# EAGLE schematic Tractive System Board Rev3 (EAGLE 9.6.2)

## Sheet 1 of 4
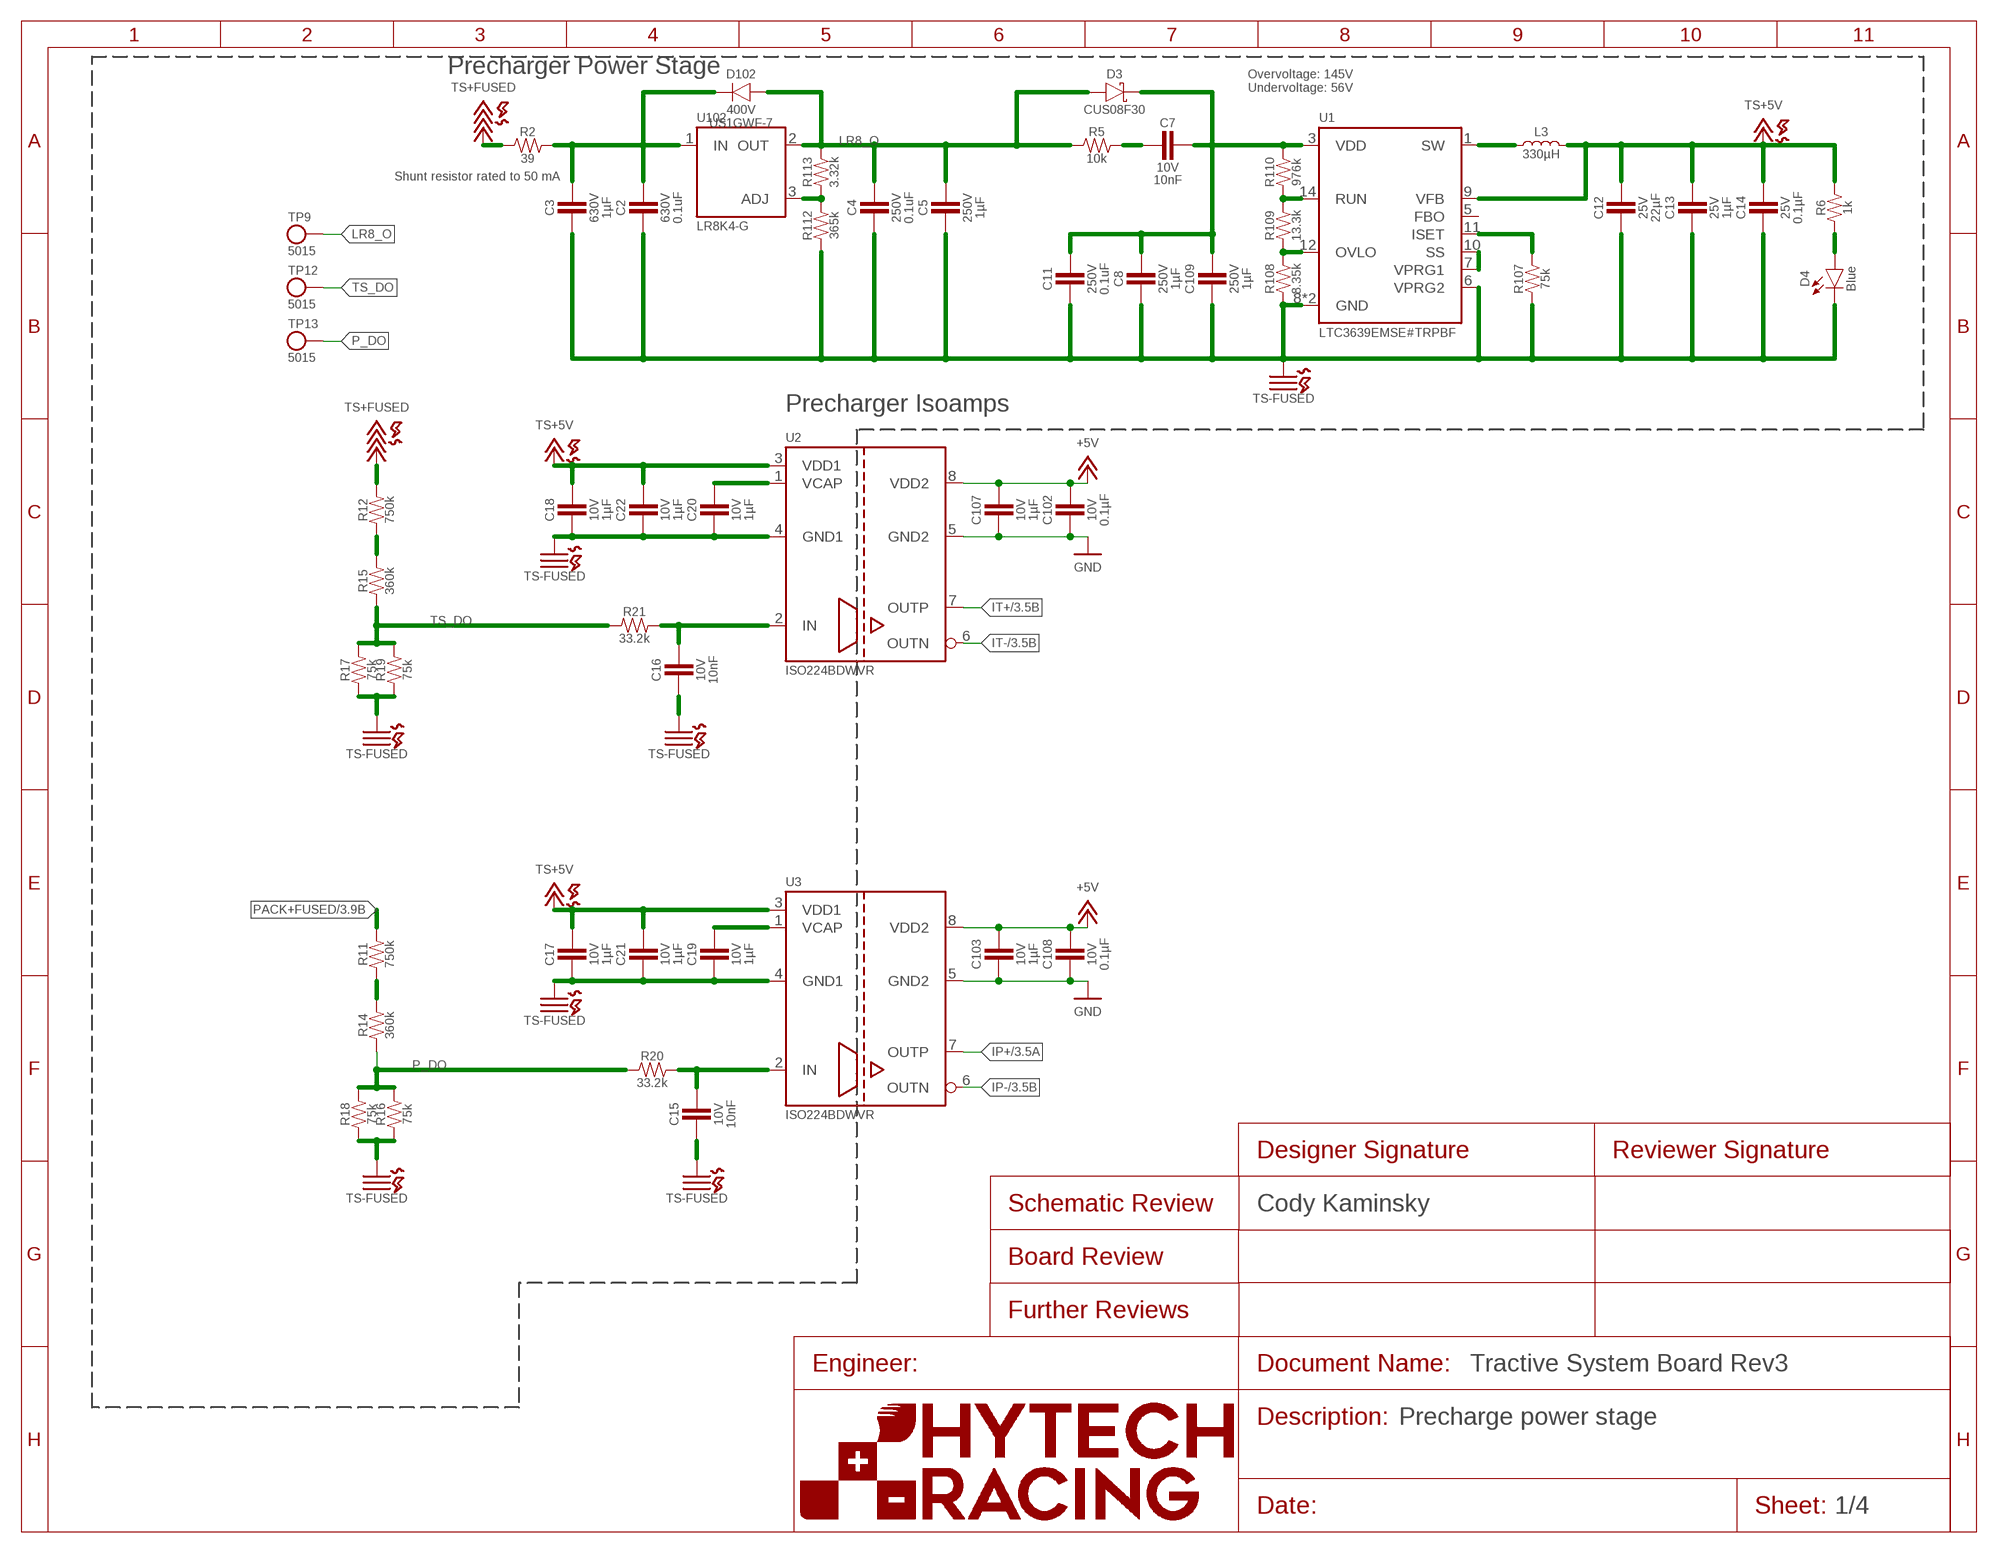
[diagram p0: schematic, sheet 1]
FRAME5 (FRAME): DESCRIPTION_1: Precharge power stage; DESIGNER_SCHEMATIC: Cody Kaminsky

### Parts
C2  CAPACITOR_2220_630V_0.1UF  [2220-CAP]
C3  CAPACITOR_2220_630V_1UF  [2220-CAP]
C4  CAPACITOR_1206_250V_0.1UF  [1206-CAP]
C5  CAPACITOR_2220_250V_1UF  [2220-CAP]
C7  CAPACITOR_0603_10V_10NF  [0603-CAP]
C8  CAPACITOR_2220_250V_1UF  [2220-CAP]
C11  CAPACITOR_1206_250V_0.1UF  [1206-CAP]
C12  CAPACITOR_0805_25V_22UF  [0805-CAP]
C13  CAPACITOR_0603_25V_1UF  [0603-CAP]
C14  CAPACITOR_0603_25V_0.1UF  [0603-CAP]
C15  CAPACITOR_0603_10V_10NF  [0603-CAP]
C16  CAPACITOR_0603_10V_10NF  [0603-CAP]
C17  CAPACITOR_0603_10V_1UF  [0603-CAP]
C18  CAPACITOR_0603_10V_1UF  [0603-CAP]
C19  CAPACITOR_0603_10V_1UF  [0603-CAP]
C20  CAPACITOR_0603_10V_1UF  [0603-CAP]
C21  CAPACITOR_0603_10V_1UF  [0603-CAP]
C22  CAPACITOR_0603_10V_1UF  [0603-CAP]
C102  CAPACITOR_0603_10V_0.1UF  [0603-CAP]
C103  CAPACITOR_0603_10V_1UF  [0603-CAP]
C107  CAPACITOR_0603_10V_1UF  [0603-CAP]
C108  CAPACITOR_0603_10V_0.1UF  [0603-CAP]
C109  CAPACITOR_2220_250V_1UF  [2220-CAP]
D3  SCHOTTKY_SOD323_30V  [SOD-323]
D4  LED_0603_BLUE  [0603-LED]
D102  RECTIFIER_400V_SOD123  [SOD123F]
L3  INDUCTOR_SRU1048_330UH  [SRU1048]
R2  RESISTOR_0603_39  [0603-RES]
R5  RESISTOR_0603_10K  [0603-RES]
R6  RESISTOR_0603_1K  [0603-RES]
R11  RESISTOR_0603_HV750K  [0603-RES]
R12  RESISTOR_0603_HV750K  [0603-RES]
R14  RESISTOR_0603_360K  [0603-RES]
R15  RESISTOR_0603_360K  [0603-RES]
R16  RESISTOR_0603_HV75K  [0603-RES]
R17  RESISTOR_0603_HV75K  [0603-RES]
R18  RESISTOR_0603_HV75K  [0603-RES]
R19  RESISTOR_0603_HV75K  [0603-RES]
R20  RESISTOR_0603_33.2K  [0603-RES]
R21  RESISTOR_0603_33.2K  [0603-RES]
R107  RESISTOR_0603_75K  [0603-RES]
R108  RESISTOR_0603_8.35K  [0603-RES]
R109  RESISTOR_0603_13.3K  [0603-RES]
R110  RESISTOR_0805_976K  [0805-RES]
R112  RESISTOR_0805_HV365K  [0805-RES]
R113  RESISTOR_0603_3.32K  [0603-RES]
TP9  TEST_POINT  [MICRO_MINIATURE]
TP12  TEST_POINT  [MICRO_MINIATURE]
TP13  TEST_POINT  [MICRO_MINIATURE]
U1  LTC3639  [MSE16(12)]
U2  ISO224B_AIRGAP  [SOIC-08(WIDE,0.295")-AIRGAP]
U3  ISO224B_AIRGAP  [SOIC-08(WIDE,0.295")-AIRGAP]
U102  VOLTAGE_REGULATOR_ADJ_LR8_DPAK  [DPAK(2-7K1S)]

### Nets
+5V: C102.1 C103.1 C107.1 C108.1 U2.8(VDD2) U3.8(VDD2) ; also sheet 2,3
GND: C102.2 C103.2 C107.2 C108.2 U2.5(GND2) U3.5(GND2) ; also sheet 2,3
IP+: U3.7(OUTP) ; also sheet 3
IP-: U3.6(OUTN) ; also sheet 3
IT+: U2.7(OUTP) ; also sheet 3
IT-: U2.6(OUTN) ; also sheet 3
LR8_O: C4.1 C5.1 D3.A D102.A R5.1 R113.2 TP9.1 U102.2(OUT)
N$1: R11.1 R14.2
N$2: R108.2 R109.1 U1.12(OVLO)
N$5: R109.2 R110.1 U1.14(RUN)
N$7: R12.1 R15.2
N$8: R112.2 R113.1 U102.3(ADJ)
N$15: C2.1 C3.1 D102.C R2.2 U102.1(IN)
N$35: D4.2(A) R6.1
N$60: C7.2 R5.2
N$61: C7.1 C8.1 C11.1 C109.1 D3.C R110.2 U1.3(VDD)
N$62: C15.1 R20.2 U3.2(IN)
N$63: C16.1 R21.2 U2.2(IN)
N$64: R107.2 U1.11(ISET)
N$65: L3.1 U1.1(SW)
N$69: C19.1 U3.1(VCAP)
N$73: C20.1 U2.1(VCAP)
N$76: U1.7(VPRG1) U1.10(SS)
P_DO: R14.1 R16.2 R18.2 R20.1 TP13.1
PACK+FUSED: R11.2 ; also sheet 3
TS+5V: C12.1 C13.1 C14.1 C17.1 C18.1 C21.1 C22.1 L3.2 R6.2 U1.9(VFB) U2.3(VDD1) U3.3(VDD1) ; also sheet 3
TS+FUSED: R2.1 R12.2 ; also sheet 2,3
TS-FUSED: C2.2 C3.2 C4.2 C5.2 C8.2 C11.2 C12.2 C13.2 C14.2 C15.2 C16.2 C17.2 C18.2 C19.2 C20.2 C21.2 C22.2 C109.2 D4.1(C) R16.1 R17.1 R18.1 R19.1 R107.1 R108.1 R112.1 U1.6(VPRG2) U1.8(GND) U1.16(GND) U2.4(GND1) U3.4(GND1) ; also sheet 2,3
TS_DO: R15.1 R17.2 R19.2 R21.1 TP12.1
Unconnected: U1.5(FBO)

### Notes on the sheet
- Precharger Power Stage
- Overvoltage: 145V
  Undervoltage: 56V
- Shunt resistor rated to 50 mA
- Precharger Isoamps

## Sheet 2 of 4
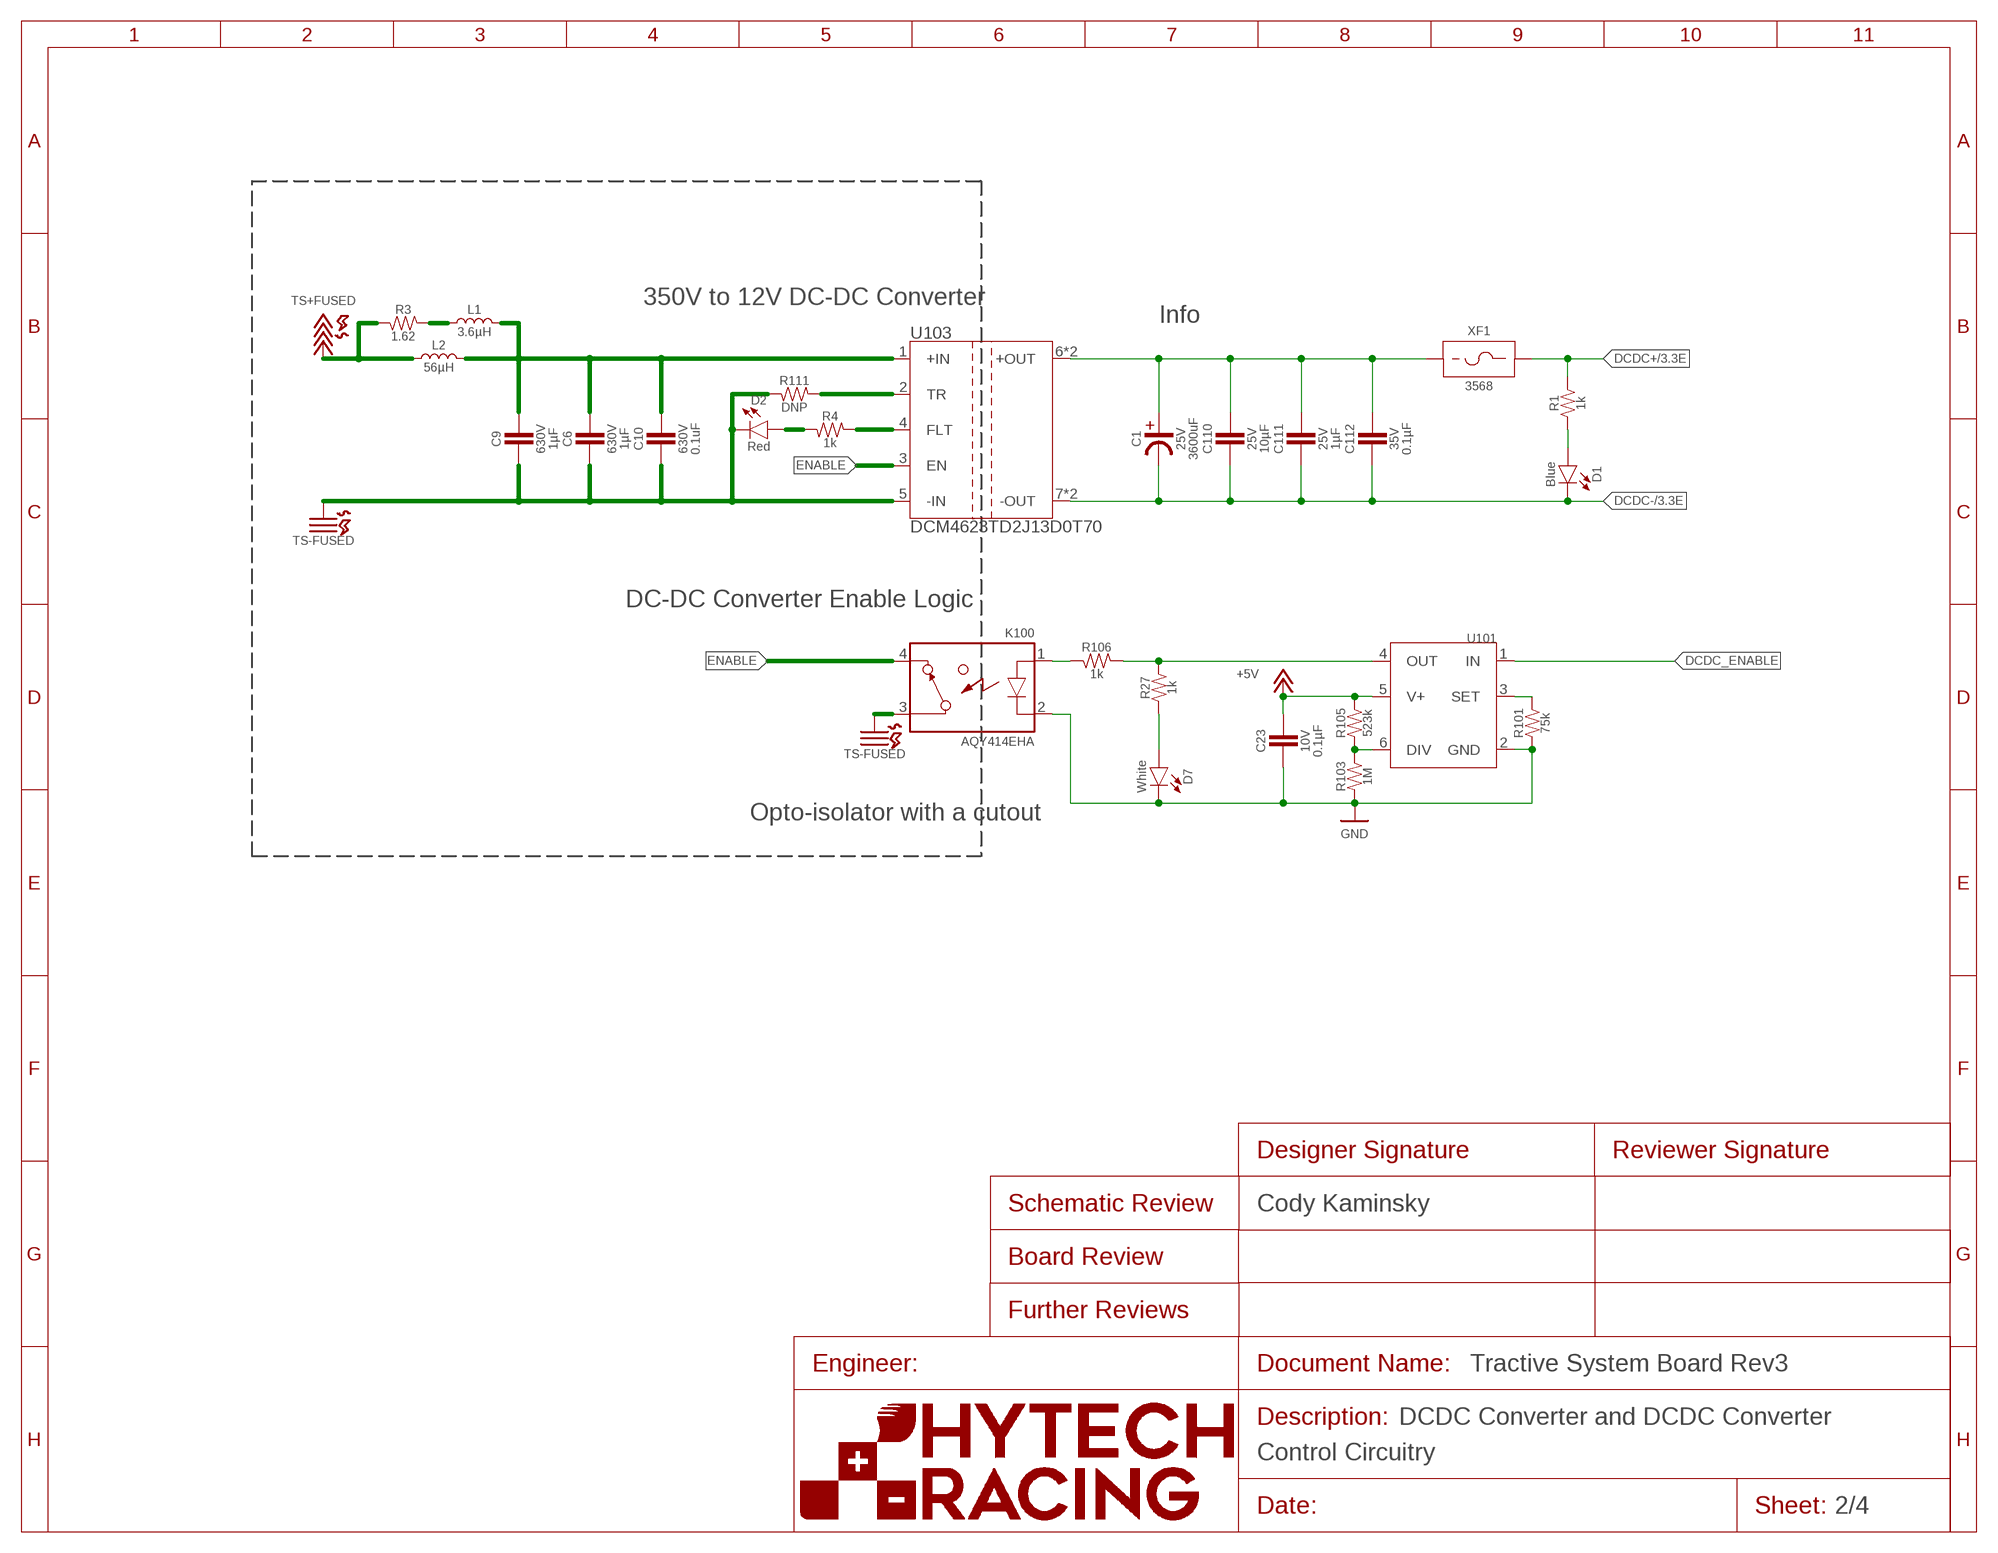
[diagram p1: schematic, sheet 2]
FRAME3 (FRAME): DESCRIPTION_1: DCDC Converter and DCDC Converter; DESCRIPTION_2: Control Circuitry; DESIGNER_SCHEMATIC: Cody Kaminsky

### Parts
C1  CAPACITOR_POLAR__3600UF  [EKYC*MM]
C6  CAPACITOR_2220_630V_1UF  [2220-CAP]
C9  CAPACITOR_2220_630V_1UF  [2220-CAP]
C10  CAPACITOR_2220_630V_0.1UF  [2220-CAP]
C23  CAPACITOR_0603_10V_0.1UF  [0603-CAP]
C110  CAPACITOR_0603_25V_10UF  [0603-CAP]
C111  CAPACITOR_0603_25V_1UF  [0603-CAP]
C112  CAPACITOR_0603_35V_0.1UF  [0603-CAP]
D1  LED_0603_BLUE  [0603-LED]
D2  LED_0603_RED  [0603-LED]
D7  LED_0603_WHITE  [0603-LED]
K100  RELAY_SOLIDSTATE_NC_AG  [DIP-4_AIRGAP]
L1  INDUCTOR_PA4334_3.6UH  [PA4334]
L2  INDUCTOR_WELMHI_56UH  [WE-LMHI]
R1  RESISTOR_0603_1K  [0603-RES]
R3  RESISTOR_0603_1.62  [0603-RES]
R4  RESISTOR_0603_1K  [0603-RES]
R27  RESISTOR_0603_1K  [0603-RES]
R101  RESISTOR_0603_75K  [0603-RES]
R103  RESISTOR_0805_1M  [0805-RES]
R105  RESISTOR_0805_523K  [0805-RES]
R106  RESISTOR_0603_1K  [0603-RES]
R111  RESISTOR_0603_DNP  [0603-RES]
U101  LTC6994-2  [SOT-23-6]
U103  DCM4623TD2J13D0T70  [DCM4623]
XF1  FUSE_HOLDER_MINIBLADEPTH  [3568]

### Nets
+5V: C23.1 R105.2 U101.5(V+) ; also sheet 1,3
DCDC+: R1.2 XF1.3 XF1.4 ; also sheet 3
DCDC-: C1.-(MINUS) C110.1 C111.1 C112.1 D1.1(C) U103.7(-OUT) U103.9(-OUT) ; also sheet 3
DCDC_ENABLE: U101.1(IN) ; also sheet 3
ENABLE: K100.4(CONTACT2) U103.3(EN)
GND: C23.2 D7.1(C) K100.2(CONTROL-) R101.1 R103.1 U101.2(GND) ; also sheet 1,3
N$4: R103.2 R105.1 U101.6(DIV)
N$6: K100.1(CONTROL+) R106.2
N$14: R101.2 U101.3(SET)
N$16: R27.2 R106.1 U101.4(OUT)
N$17: D7.2(A) R27.1
N$18: D1.2(A) R1.1
N$29: L1.2 R3.1
N$39: C6.1 C9.1 C10.1 L1.1 L2.1 U103.1(+IN)
N$43: D2.2(A) R4.2
N$44: R4.1 U103.4(FLT)
N$45: R111.1 U103.2(TR)
N$46: C1.+(PLUS) C110.2 C111.2 C112.2 U103.6(+OUT) U103.8(+OUT) XF1.1 XF1.2
TS+FUSED: L2.2 R3.2 ; also sheet 1,3
TS-FUSED: C6.2 C9.2 C10.2 D2.1(C) K100.3(CONTACT1) R111.2 U103.5(-IN) ; also sheet 1,3

### Notes on the sheet
- 350V to 12V DC-DC Converter
- Info
- DC-DC Converter Enable Logic
- Opto-isolator with a cutout

## Sheet 3 of 4
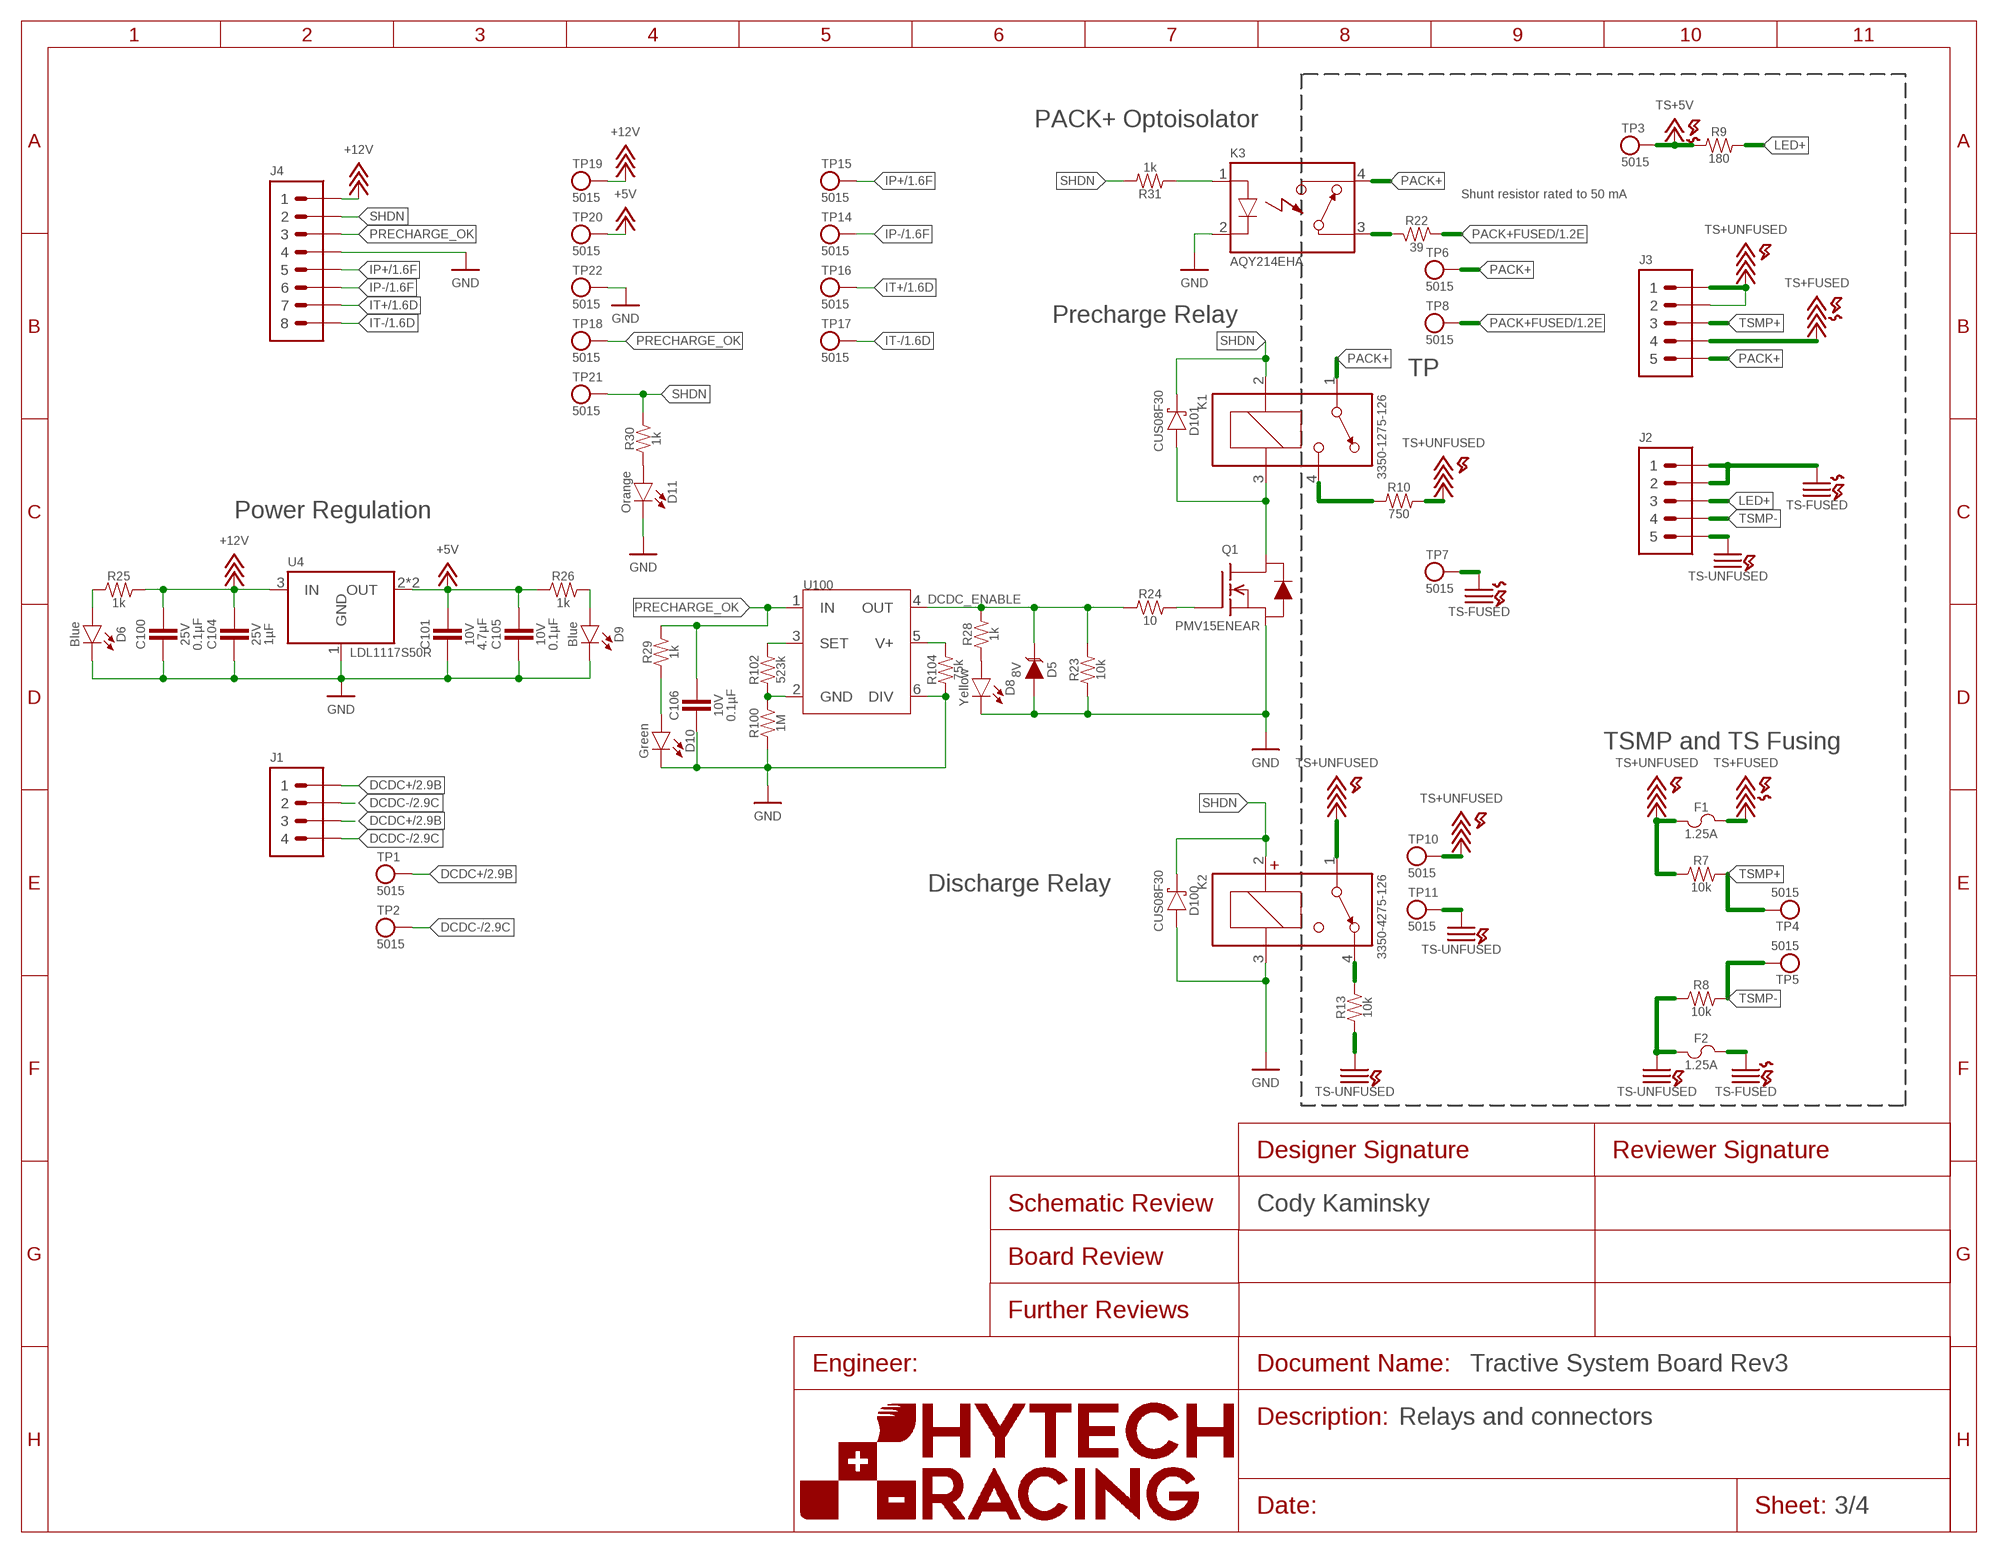
[diagram p2: schematic, sheet 3]
FRAME4 (FRAME): DESCRIPTION_1: Relays and connectors; DESIGNER_SCHEMATIC: Cody Kaminsky

### Parts
C100  CAPACITOR_0603_25V_0.1UF  [0603-CAP]
C101  CAPACITOR_0603_10V_4.7UF  [0603-CAP]
C104  CAPACITOR_0603_25V_1UF  [0603-CAP]
C105  CAPACITOR_0603_10V_0.1UF  [0603-CAP]
C106  CAPACITOR_0603_10V_0.1UF  [0603-CAP]
D5  TVS_8V  [SOT-23]
D6  LED_0603_BLUE  [0603-LED]
D8  LED_0603_YELLOW  [0603-LED]
D9  LED_0603_BLUE  [0603-LED]
D10  LED_0603_GREEN  [0603-LED]
D11  LED_0603_ORANGE  [0603-LED]
D100  SCHOTTKY_SOD323_30V  [SOD-323]
D101  SCHOTTKY_SOD323_30V  [SOD-323]
F1  FUSE_0885_1.25  [0885]
F2  FUSE_0885_1.25  [0885]
J1  CONNECTOR-4__  [MOLEX_MICROFIT_PTH_VERTICAL_04_DUAL]
J2  CONNECTOR-5_MICRO_V6S_  [MOLEX_MICROFIT_PTH_VERTICAL_06_SINGLE_SPACED]
J3  CONNECTOR-5_MICRO_V7S_  [MOLEX_MICROFIT_PTH_VERTICAL_07_SINGLE_SPACED]
J4  CONNECTOR-8_S_S  [FLEX_STACK_PTH_08_DUAL]
K1  RELAY_SPST_NO_3550_12  [335X]
K2  RELAY_SPST_NC_POLARIZED_3550_12  [335X]
K3  RELAY_SOLIDSTATE_NO_AG  [DIP-4_AIRGAP]
Q1  TRANSISTOR_N_MOS__PMV15ENEA  [SOT-23]
R7  RESISTOR_B20_10K  [B20]
R8  RESISTOR_B20_10K  [B20]
R9  RESISTOR_0603_180  [0603-RES]
R10  RESISTOR_B20_750  [B20]
R13  RESISTOR_B20_10K  [B20]
R22  RESISTOR_0603_39  [0603-RES]
R23  RESISTOR_0603_10K  [0603-RES]
R24  RESISTOR_0603_10  [0603-RES]
R25  RESISTOR_0603_1K  [0603-RES]
R26  RESISTOR_0603_1K  [0603-RES]
R28  RESISTOR_0603_1K  [0603-RES]
R29  RESISTOR_0603_1K  [0603-RES]
R30  RESISTOR_0603_1K  [0603-RES]
R31  RESISTOR_0603_1K  [0603-RES]
R100  RESISTOR_0805_1M  [0805-RES]
R102  RESISTOR_0805_523K  [0805-RES]
R104  RESISTOR_0603_75K  [0603-RES]
TP1  TEST_POINT  [MICRO_MINIATURE]
TP2  TEST_POINT  [MICRO_MINIATURE]
TP3  TEST_POINT  [MICRO_MINIATURE]
TP4  TEST_POINT  [MICRO_MINIATURE]
TP5  TEST_POINT  [MICRO_MINIATURE]
TP6  TEST_POINT  [MICRO_MINIATURE]
TP7  TEST_POINT  [MICRO_MINIATURE]
TP8  TEST_POINT  [MICRO_MINIATURE]
TP10  TEST_POINT  [MICRO_MINIATURE]
TP11  TEST_POINT  [MICRO_MINIATURE]
TP14  TEST_POINT  [MICRO_MINIATURE]
TP15  TEST_POINT  [MICRO_MINIATURE]
TP16  TEST_POINT  [MICRO_MINIATURE]
TP17  TEST_POINT  [MICRO_MINIATURE]
TP18  TEST_POINT  [MICRO_MINIATURE]
TP19  TEST_POINT  [MICRO_MINIATURE]
TP20  TEST_POINT  [MICRO_MINIATURE]
TP21  TEST_POINT  [MICRO_MINIATURE]
TP22  TEST_POINT  [MICRO_MINIATURE]
U4  VOLTAGE_REGULATOR_SOT223_5V  [SOT223]
U100  LTC6994-2  [SOT-23-6]

### Nets
+5V: C101.1 C105.1 R26.1 TP20.1 U4.2(OUT) U4.4(OUT) ; also sheet 1,2
+12V: C100.1 C104.1 J4.1 R25.2 TP19.1 U4.3(IN)
DCDC+: J1.1 J1.3 TP1.1 ; also sheet 2
DCDC-: J1.2 J1.4 TP2.1 ; also sheet 2
DCDC_ENABLE: D5.3(C) R23.2 R24.1 R28.2 U100.4(OUT) ; also sheet 2
GND: C100.2 C101.2 C104.2 C105.2 C106.2 D5.1(A) D6.1(C) D8.1(C) D9.1(C) D10.1(C) D11.1(C) D100.A J4.4 K2.3(COIL-) K3.2(CONTROL-) Q1.2(S) R23.1 R100.1 R104.1 TP22.1 U4.1(GND) U100.6(DIV) ; also sheet 1,2
IP+: J4.5 TP15.1 ; also sheet 1
IP-: J4.6 TP14.1 ; also sheet 1
IT+: J4.7 TP16.1 ; also sheet 1
IT-: J4.8 TP17.1 ; also sheet 1
LED+: J2.3 R9.2
N$3: Q1.1(G) R24.2
N$9: R100.2 R102.1 U100.2(GND)
N$10: R102.2 U100.3(SET)
N$12: R104.2 U100.5(V+)
N$22: D10.2(A) R29.1
N$24: D8.2(A) R28.1
N$25: D6.2(A) R25.1
N$30: D9.2(A) R26.2
N$31: D11.2(A) R30.1
N$40: D101.A K1.3(COIL-) Q1.3(D)
N$50: K1.4(CONTACT2) R10.1
N$51: K2.4(CONTACT2) R13.2
N$53: K3.1(CONTROL+) R31.1
N$57: K3.3(CONTACT1) R22.2
PACK+: J3.5 K1.1(CONTACT1) K3.4(CONTACT2) TP6.1
PACK+FUSED: R22.1 TP8.1 ; also sheet 1
PRECHARGE_OK: C106.1 J4.3 R29.2 TP18.1 U100.1(IN)
SHDN: D100.C D101.C J4.2 K1.2(COIL+) K2.2(COIL+) R30.2 R31.2 TP21.1
TS+5V: R9.1 TP3.1 ; also sheet 1
TS+FUSED: F1.2 J3.4 ; also sheet 1,2
TS+UNFUSED: F1.1 J3.1 J3.2 K2.1(CONTACT1) R7.1 R10.2 TP10.1
TS-FUSED: F2.2 J2.1 J2.2 TP7.1 ; also sheet 1,2
TS-UNFUSED: F2.1 J2.5 R8.1 R13.1 TP11.1
TSMP+: J3.3 R7.2 TP4.1
TSMP-: J2.4 R8.2 TP5.1

### Notes on the sheet
- PACK+ Optoisolator
- Shunt resistor rated to 50 mA
- Precharge Relay
- TP
- Power Regulation
- TSMP and TS Fusing
- Discharge Relay

## Sheet 4 of 4
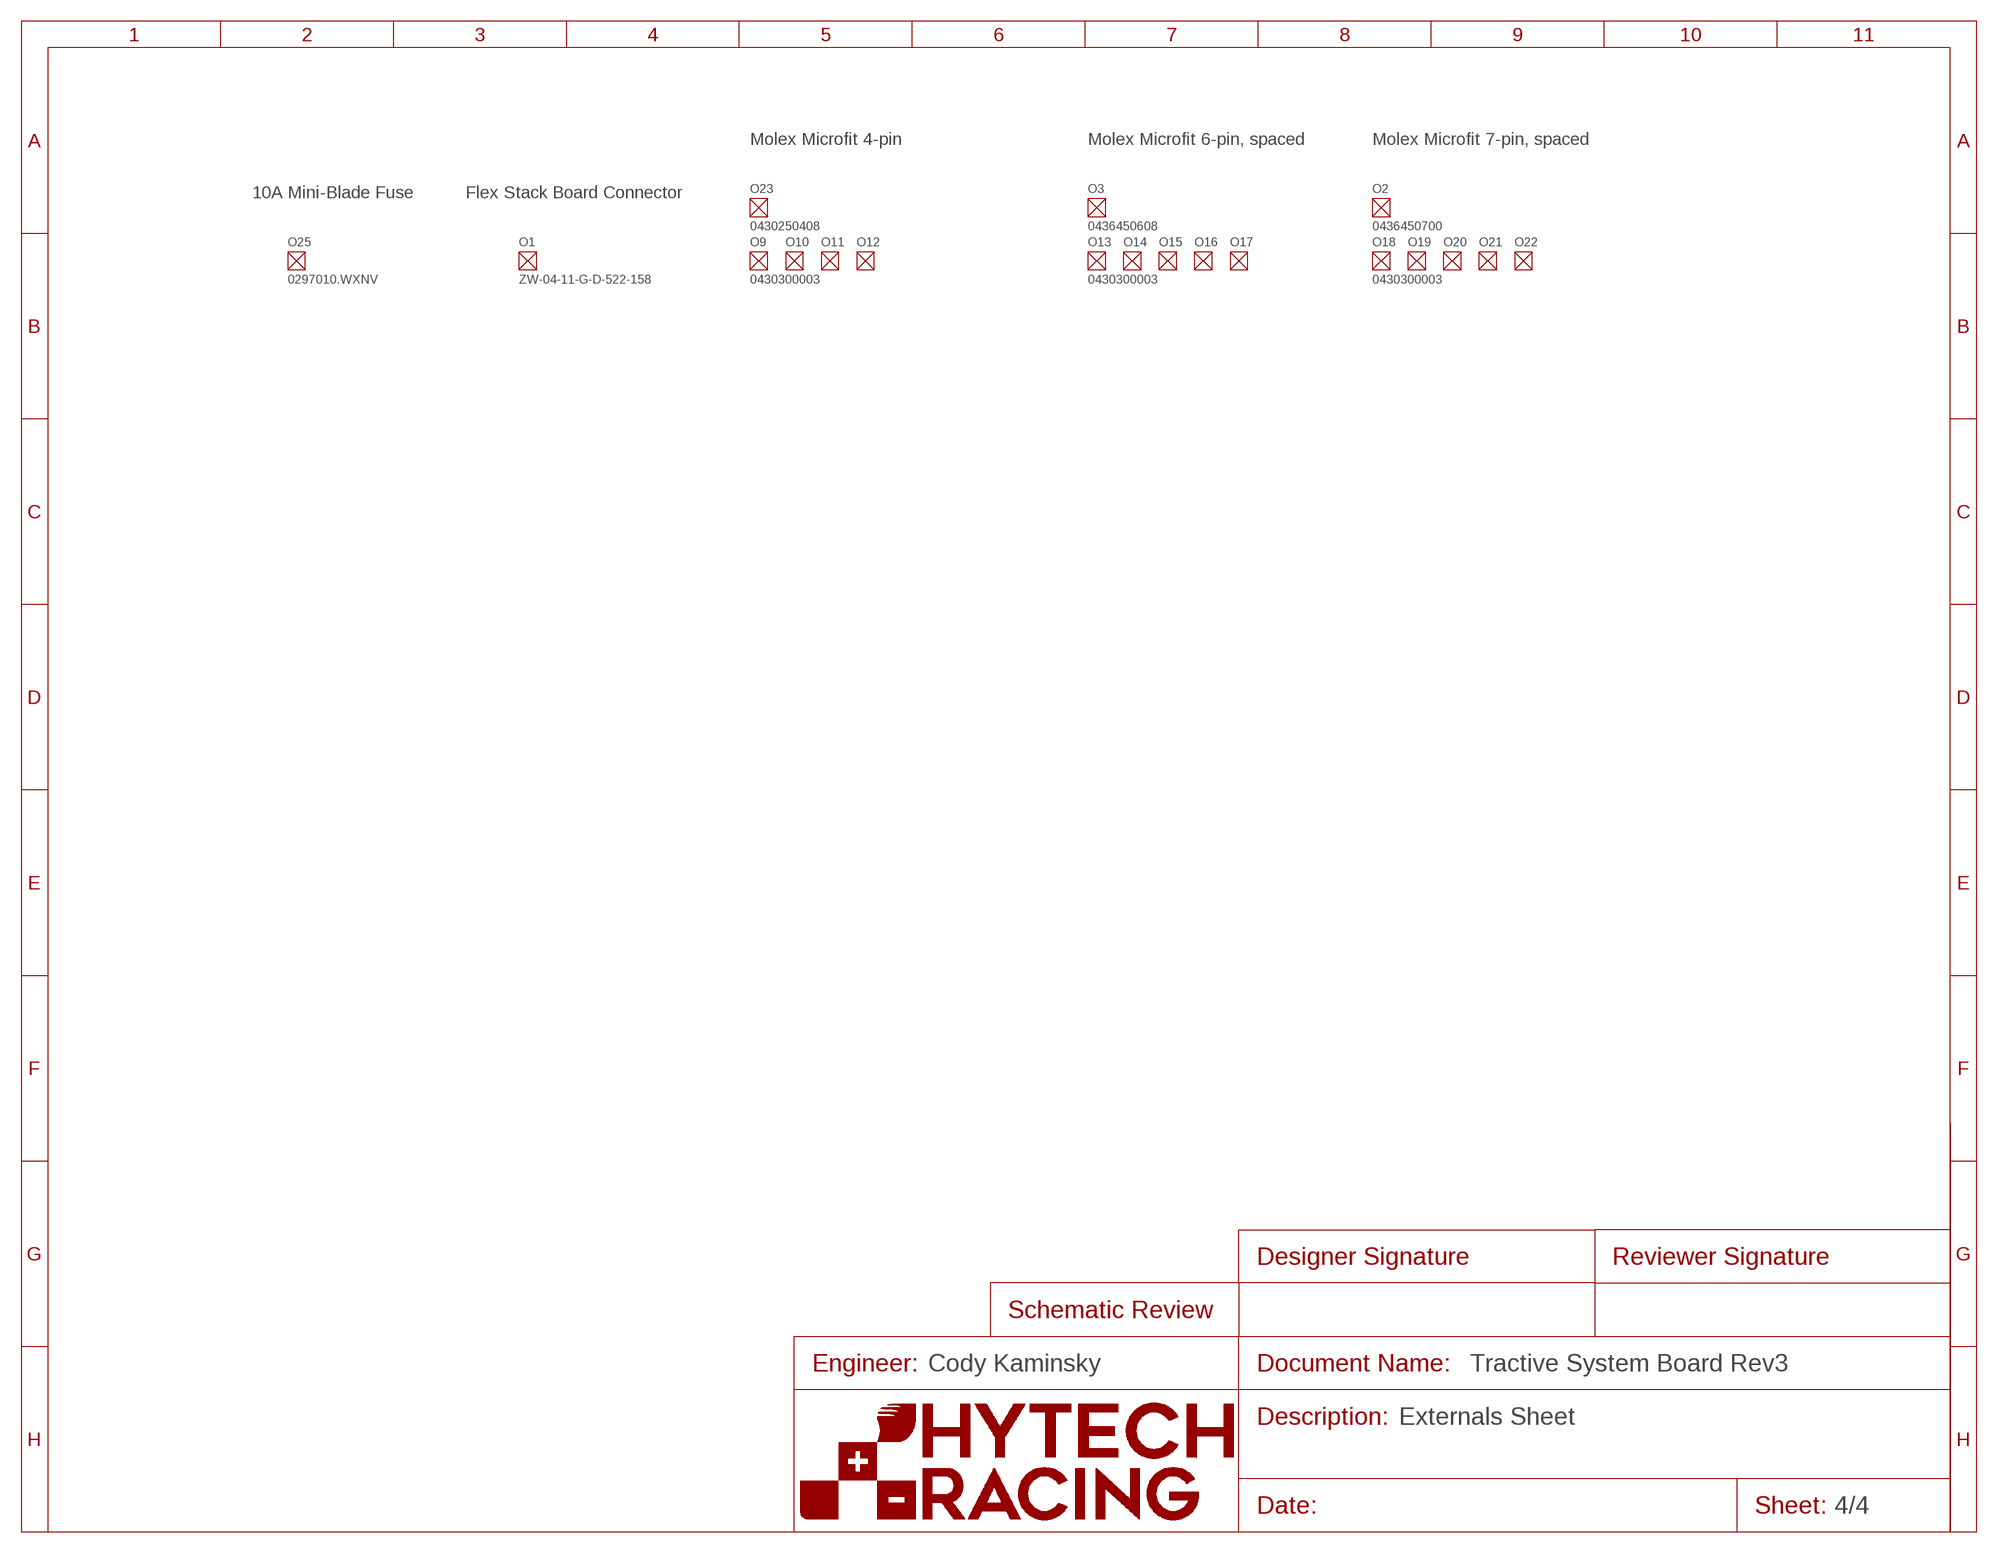
[diagram p3: schematic, sheet 4]
O1 (RECEPTACLE-8_FLEXSTACK): DKPN: ZW-04-11-G-D-522-158-ND; MANUFACTURER: Samtec Inc; MOPN: 200-ZW0411GD522158; MPN: ZW-04-11-G-D-522-158
O2 (RECEPTACLE-7_MICROFIT): DKPN: WM2405-ND; MANUFACTURER: Molex; MOPN: 538-43645-0700; MPN: 0436450700
O3 (RECEPTACLE-6_SINGLE_MICROFIT): DKPN: WM13217-ND; MANUFACTURER: Molex; MOPN: 538-43645-0608; MPN: 0436450608
O9 (CRIMP_MICROFIT_20-24): DKPN: WM2776CT-ND; GAUGE: 20-24; MANUFACTURER: Molex; MOPN: 538-43030-0003; MPN: 0430300003
O10 (CRIMP_MICROFIT_20-24): DKPN: WM2776CT-ND; GAUGE: 20-24; MANUFACTURER: Molex; MOPN: 538-43030-0003; MPN: 0430300003
O11 (CRIMP_MICROFIT_20-24): DKPN: WM2776CT-ND; GAUGE: 20-24; MANUFACTURER: Molex; MOPN: 538-43030-0003; MPN: 0430300003
O12 (CRIMP_MICROFIT_20-24): DKPN: WM2776CT-ND; GAUGE: 20-24; MANUFACTURER: Molex; MOPN: 538-43030-0003; MPN: 0430300003
O13 (CRIMP_MICROFIT_20-24): DKPN: WM2776CT-ND; GAUGE: 20-24; MANUFACTURER: Molex; MOPN: 538-43030-0003; MPN: 0430300003
O14 (CRIMP_MICROFIT_20-24): DKPN: WM2776CT-ND; GAUGE: 20-24; MANUFACTURER: Molex; MOPN: 538-43030-0003; MPN: 0430300003
O15 (CRIMP_MICROFIT_20-24): DKPN: WM2776CT-ND; GAUGE: 20-24; MANUFACTURER: Molex; MOPN: 538-43030-0003; MPN: 0430300003
O16 (CRIMP_MICROFIT_20-24): DKPN: WM2776CT-ND; GAUGE: 20-24; MANUFACTURER: Molex; MOPN: 538-43030-0003; MPN: 0430300003
O17 (CRIMP_MICROFIT_20-24): DKPN: WM2776CT-ND; GAUGE: 20-24; MANUFACTURER: Molex; MOPN: 538-43030-0003; MPN: 0430300003
O18 (CRIMP_MICROFIT_20-24): DKPN: WM2776CT-ND; GAUGE: 20-24; MANUFACTURER: Molex; MOPN: 538-43030-0003; MPN: 0430300003
O19 (CRIMP_MICROFIT_20-24): DKPN: WM2776CT-ND; GAUGE: 20-24; MANUFACTURER: Molex; MOPN: 538-43030-0003; MPN: 0430300003
O20 (CRIMP_MICROFIT_20-24): DKPN: WM2776CT-ND; GAUGE: 20-24; MANUFACTURER: Molex; MOPN: 538-43030-0003; MPN: 0430300003
O21 (CRIMP_MICROFIT_20-24): DKPN: WM2776CT-ND; GAUGE: 20-24; MANUFACTURER: Molex; MOPN: 538-43030-0003; MPN: 0430300003
O22 (CRIMP_MICROFIT_20-24): DKPN: WM2776CT-ND; GAUGE: 20-24; MANUFACTURER: Molex; MOPN: 538-43030-0003; MPN: 0430300003
O23 (RECEPTACLE-4_MICROFIT): DKPN: WM11225-ND; MANUFACTURER: Molex; MOPN: 538-43025-0408; MPN: 0430250408
O25 (FUSE_MINI_BLADE_10): DKPN: F991-ND; MANUFACTURER: Littelfuse; MOPN: 576-0297010.WXNV; MPN: 0297010.WXNV
U$49 (FRAME_SCHEMATIC_ONLY): DESCRIPTION_1: Externals Sheet; ENGINEER: Cody Kaminsky

### Notes on the sheet
- Molex Microfit 4-pin | Molex Microfit 6-pin, spaced | Molex Microfit 7-pin, spaced
- 10A Mini-Blade Fuse | Flex Stack Board Connector

## Library data of the parts
C1 = HyTechDevices:CAPACITOR_POLAR_?_*; CAPACITANCE: 3600uF; DKPN: 565-EKYC250ELL362ML20S-ND; MANUFACTURER: United Chemi-con; MOPN: 661-YC250ELL362ML20S; MPN: EKYC250ELL362ML20S; VOLTAGE: 25V
C2 C10 = HyTechDevices:CAPACITOR_?_*: Capacitor, Non-Polarized VJ...1BC Series Datasheet <https://www.mouser.com/datasheet/2/427/vjw1bcbascomseries-1762447.pdf> Samsung Datasheet <https://www.mouser.com/datasheet/2/585/MLCC-1837944.pdf> Walsin Datasheet <https://www.mouser.com/datasheet/2/210/WTC_MLCC_General_Purpose-1534899.pdf> GRM188R61A226ME15D <https://www.mouser.com/datasheet/2/281/1/GRM188R61A226ME15_02A-1985787.pdf> GRM188R61E106MA73D <https://www.mouser.com/datasheet/2/281/1/GRM188R61E106MA73_01A-1985806.pdf> 885012006013 <https://www.mouser.com/datasheet/2/445/885012006013-1726946.pdf> 2220Y6300105KXTWS2 <https://www.mouser.com/datasheet/2/218/SMD_High_and_Std_StackiCap_P62-1825512.pdf> Yageo Class 2, X5R <https://www.mouser.com/datasheet/2/447/UPY_GPHC_X5R_4V_to_50V_26-1827097.pdf> TDK C Series <https://www.mouser.com/ProductDetail/TDK/C3216X5R1V226M160AC?qs=%2Fha2pyFadujbcx9jh7lYl%2F4NeMoXFhdc8AqVWNq4wW6M2y7zl6GzBuhgtI0ngznN> AVX Automotive MLCC <https://www.mouser.com/datasheet/2/40/AutoMLCC-777028.pdf> KEMET X7R Series <https://www.mouser.com/datasheet/2/212/KEM_C1002_X7R_SMD-1102033.pdf>; CAPACITANCE: 0.1uF; DKPN: 445-11980-2-ND; MANUFACTURER: TDK Coporation; MOPN: 810-C5750CH2J104K2KC; MPN: C5750CH2J104K280KC; TOLERANCE: 10%; VOLTAGE: 630V
C3 C6 C9 = HyTechDevices:CAPACITOR_?_*: Capacitor, Non-Polarized VJ...1BC Series Datasheet <https://www.mouser.com/datasheet/2/427/vjw1bcbascomseries-1762447.pdf> Samsung Datasheet <https://www.mouser.com/datasheet/2/585/MLCC-1837944.pdf> Walsin Datasheet <https://www.mouser.com/datasheet/2/210/WTC_MLCC_General_Purpose-1534899.pdf> GRM188R61A226ME15D <https://www.mouser.com/datasheet/2/281/1/GRM188R61A226ME15_02A-1985787.pdf> GRM188R61E106MA73D <https://www.mouser.com/datasheet/2/281/1/GRM188R61E106MA73_01A-1985806.pdf> 885012006013 <https://www.mouser.com/datasheet/2/445/885012006013-1726946.pdf> 2220Y6300105KXTWS2 <https://www.mouser.com/datasheet/2/218/SMD_High_and_Std_StackiCap_P62-1825512.pdf> Yageo Class 2, X5R <https://www.mouser.com/datasheet/2/447/UPY_GPHC_X5R_4V_to_50V_26-1827097.pdf> TDK C Series <https://www.mouser.com/ProductDetail/TDK/C3216X5R1V226M160AC?qs=%2Fha2pyFadujbcx9jh7lYl%2F4NeMoXFhdc8AqVWNq4wW6M2y7zl6GzBuhgtI0ngznN> AVX Automotive MLCC <https://www.mouser.com/datasheet/2/40/AutoMLCC-777028.pdf> KEMET X7R Series <https://www.mouser.com/datasheet/2/212/KEM_C1002_X7R_SMD-1102033.pdf>; CAPACITANCE: 1µF; DKPN: 1608-2220Y6300105KXTWS2CT-ND; MANUFACTURER: Knowles Syfer; MOPN: 843-2220Y63105KXTWS2; MPN: 2220Y6300105KXTWS2; TOLERANCE: 10%; VOLTAGE: 630V
C4 C11 = HyTechDevices:CAPACITOR_?_*: Capacitor, Non-Polarized VJ...1BC Series Datasheet <https://www.mouser.com/datasheet/2/427/vjw1bcbascomseries-1762447.pdf> Samsung Datasheet <https://www.mouser.com/datasheet/2/585/MLCC-1837944.pdf> Walsin Datasheet <https://www.mouser.com/datasheet/2/210/WTC_MLCC_General_Purpose-1534899.pdf> GRM188R61A226ME15D <https://www.mouser.com/datasheet/2/281/1/GRM188R61A226ME15_02A-1985787.pdf> GRM188R61E106MA73D <https://www.mouser.com/datasheet/2/281/1/GRM188R61E106MA73_01A-1985806.pdf> 885012006013 <https://www.mouser.com/datasheet/2/445/885012006013-1726946.pdf> 2220Y6300105KXTWS2 <https://www.mouser.com/datasheet/2/218/SMD_High_and_Std_StackiCap_P62-1825512.pdf> Yageo Class 2, X5R <https://www.mouser.com/datasheet/2/447/UPY_GPHC_X5R_4V_to_50V_26-1827097.pdf> TDK C Series <https://www.mouser.com/ProductDetail/TDK/C3216X5R1V226M160AC?qs=%2Fha2pyFadujbcx9jh7lYl%2F4NeMoXFhdc8AqVWNq4wW6M2y7zl6GzBuhgtI0ngznN> AVX Automotive MLCC <https://www.mouser.com/datasheet/2/40/AutoMLCC-777028.pdf> KEMET X7R Series <https://www.mouser.com/datasheet/2/212/KEM_C1002_X7R_SMD-1102033.pdf>; CAPACITANCE: 0.1uF; DKPN: 445-6079-2-ND; MANUFACTURER: TDK Corporation; MOPN: 810-C3216X7R2E104KT5; MPN: C3216X7R2E104K160AM; TOLERANCE: 10%; VOLTAGE: 250V
C5 C8 C109 = HyTechDevices:CAPACITOR_?_*: Capacitor, Non-Polarized VJ...1BC Series Datasheet <https://www.mouser.com/datasheet/2/427/vjw1bcbascomseries-1762447.pdf> Samsung Datasheet <https://www.mouser.com/datasheet/2/585/MLCC-1837944.pdf> Walsin Datasheet <https://www.mouser.com/datasheet/2/210/WTC_MLCC_General_Purpose-1534899.pdf> GRM188R61A226ME15D <https://www.mouser.com/datasheet/2/281/1/GRM188R61A226ME15_02A-1985787.pdf> GRM188R61E106MA73D <https://www.mouser.com/datasheet/2/281/1/GRM188R61E106MA73_01A-1985806.pdf> 885012006013 <https://www.mouser.com/datasheet/2/445/885012006013-1726946.pdf> 2220Y6300105KXTWS2 <https://www.mouser.com/datasheet/2/218/SMD_High_and_Std_StackiCap_P62-1825512.pdf> Yageo Class 2, X5R <https://www.mouser.com/datasheet/2/447/UPY_GPHC_X5R_4V_to_50V_26-1827097.pdf> TDK C Series <https://www.mouser.com/ProductDetail/TDK/C3216X5R1V226M160AC?qs=%2Fha2pyFadujbcx9jh7lYl%2F4NeMoXFhdc8AqVWNq4wW6M2y7zl6GzBuhgtI0ngznN> AVX Automotive MLCC <https://www.mouser.com/datasheet/2/40/AutoMLCC-777028.pdf> KEMET X7R Series <https://www.mouser.com/datasheet/2/212/KEM_C1002_X7R_SMD-1102033.pdf>; CAPACITANCE: 1µF; DKPN: 445-2304-2-ND; MANUFACTURER: TDK Corporation; MOPN: 810-C5750X7R2E105K; MPN: C5750X7R2E105K230KA; TOLERANCE: 10%; VOLTAGE: 250V
C7 C15 C16 = HyTechDevices:CAPACITOR_?_*: Capacitor, Non-Polarized VJ...1BC Series Datasheet <https://www.mouser.com/datasheet/2/427/vjw1bcbascomseries-1762447.pdf> Samsung Datasheet <https://www.mouser.com/datasheet/2/585/MLCC-1837944.pdf> Walsin Datasheet <https://www.mouser.com/datasheet/2/210/WTC_MLCC_General_Purpose-1534899.pdf> GRM188R61A226ME15D <https://www.mouser.com/datasheet/2/281/1/GRM188R61A226ME15_02A-1985787.pdf> GRM188R61E106MA73D <https://www.mouser.com/datasheet/2/281/1/GRM188R61E106MA73_01A-1985806.pdf> 885012006013 <https://www.mouser.com/datasheet/2/445/885012006013-1726946.pdf> 2220Y6300105KXTWS2 <https://www.mouser.com/datasheet/2/218/SMD_High_and_Std_StackiCap_P62-1825512.pdf> Yageo Class 2, X5R <https://www.mouser.com/datasheet/2/447/UPY_GPHC_X5R_4V_to_50V_26-1827097.pdf> TDK C Series <https://www.mouser.com/ProductDetail/TDK/C3216X5R1V226M160AC?qs=%2Fha2pyFadujbcx9jh7lYl%2F4NeMoXFhdc8AqVWNq4wW6M2y7zl6GzBuhgtI0ngznN> AVX Automotive MLCC <https://www.mouser.com/datasheet/2/40/AutoMLCC-777028.pdf> KEMET X7R Series <https://www.mouser.com/datasheet/2/212/KEM_C1002_X7R_SMD-1102033.pdf>; CAPACITANCE: 10nF; DKPN: 311-4054-1-ND; MANUFACTURER: Yageo; MOPN: 603-CC603KRX7R6BB103; MPN: CC0603KRX7R6BB103; TOLERANCE: 10%; VOLTAGE: 10V
C12 = HyTechDevices:CAPACITOR_?_*: Capacitor, Non-Polarized VJ...1BC Series Datasheet <https://www.mouser.com/datasheet/2/427/vjw1bcbascomseries-1762447.pdf> Samsung Datasheet <https://www.mouser.com/datasheet/2/585/MLCC-1837944.pdf> Walsin Datasheet <https://www.mouser.com/datasheet/2/210/WTC_MLCC_General_Purpose-1534899.pdf> GRM188R61A226ME15D <https://www.mouser.com/datasheet/2/281/1/GRM188R61A226ME15_02A-1985787.pdf> GRM188R61E106MA73D <https://www.mouser.com/datasheet/2/281/1/GRM188R61E106MA73_01A-1985806.pdf> 885012006013 <https://www.mouser.com/datasheet/2/445/885012006013-1726946.pdf> 2220Y6300105KXTWS2 <https://www.mouser.com/datasheet/2/218/SMD_High_and_Std_StackiCap_P62-1825512.pdf> Yageo Class 2, X5R <https://www.mouser.com/datasheet/2/447/UPY_GPHC_X5R_4V_to_50V_26-1827097.pdf> TDK C Series <https://www.mouser.com/ProductDetail/TDK/C3216X5R1V226M160AC?qs=%2Fha2pyFadujbcx9jh7lYl%2F4NeMoXFhdc8AqVWNq4wW6M2y7zl6GzBuhgtI0ngznN> AVX Automotive MLCC <https://www.mouser.com/datasheet/2/40/AutoMLCC-777028.pdf> KEMET X7R Series <https://www.mouser.com/datasheet/2/212/KEM_C1002_X7R_SMD-1102033.pdf>; CAPACITANCE: 22µF; DKPN: 311-1903-1-ND; MANUFACTURER: Yageo; MOPN: 603-CC805MKX5R8BB226; MPN: CC0805MKX5R8BB226; TOLERANCE: 20%; VOLTAGE: 25V
C13 C104 C111 = HyTechDevices:CAPACITOR_?_*: Capacitor, Non-Polarized VJ...1BC Series Datasheet <https://www.mouser.com/datasheet/2/427/vjw1bcbascomseries-1762447.pdf> Samsung Datasheet <https://www.mouser.com/datasheet/2/585/MLCC-1837944.pdf> Walsin Datasheet <https://www.mouser.com/datasheet/2/210/WTC_MLCC_General_Purpose-1534899.pdf> GRM188R61A226ME15D <https://www.mouser.com/datasheet/2/281/1/GRM188R61A226ME15_02A-1985787.pdf> GRM188R61E106MA73D <https://www.mouser.com/datasheet/2/281/1/GRM188R61E106MA73_01A-1985806.pdf> 885012006013 <https://www.mouser.com/datasheet/2/445/885012006013-1726946.pdf> 2220Y6300105KXTWS2 <https://www.mouser.com/datasheet/2/218/SMD_High_and_Std_StackiCap_P62-1825512.pdf> Yageo Class 2, X5R <https://www.mouser.com/datasheet/2/447/UPY_GPHC_X5R_4V_to_50V_26-1827097.pdf> TDK C Series <https://www.mouser.com/ProductDetail/TDK/C3216X5R1V226M160AC?qs=%2Fha2pyFadujbcx9jh7lYl%2F4NeMoXFhdc8AqVWNq4wW6M2y7zl6GzBuhgtI0ngznN> AVX Automotive MLCC <https://www.mouser.com/datasheet/2/40/AutoMLCC-777028.pdf> KEMET X7R Series <https://www.mouser.com/datasheet/2/212/KEM_C1002_X7R_SMD-1102033.pdf>; CAPACITANCE: 1µF; DKPN: 1276-1184-1-ND; MANUFACTURER: Samsung Electro-Mechanics; MOPN: 187-CL10B105KA8NNNC; MPN: CL10B105KA8NNNC; TOLERANCE: 10%; VOLTAGE: 25V
C14 C100 = HyTechDevices:CAPACITOR_?_*: Capacitor, Non-Polarized VJ...1BC Series Datasheet <https://www.mouser.com/datasheet/2/427/vjw1bcbascomseries-1762447.pdf> Samsung Datasheet <https://www.mouser.com/datasheet/2/585/MLCC-1837944.pdf> Walsin Datasheet <https://www.mouser.com/datasheet/2/210/WTC_MLCC_General_Purpose-1534899.pdf> GRM188R61A226ME15D <https://www.mouser.com/datasheet/2/281/1/GRM188R61A226ME15_02A-1985787.pdf> GRM188R61E106MA73D <https://www.mouser.com/datasheet/2/281/1/GRM188R61E106MA73_01A-1985806.pdf> 885012006013 <https://www.mouser.com/datasheet/2/445/885012006013-1726946.pdf> 2220Y6300105KXTWS2 <https://www.mouser.com/datasheet/2/218/SMD_High_and_Std_StackiCap_P62-1825512.pdf> Yageo Class 2, X5R <https://www.mouser.com/datasheet/2/447/UPY_GPHC_X5R_4V_to_50V_26-1827097.pdf> TDK C Series <https://www.mouser.com/ProductDetail/TDK/C3216X5R1V226M160AC?qs=%2Fha2pyFadujbcx9jh7lYl%2F4NeMoXFhdc8AqVWNq4wW6M2y7zl6GzBuhgtI0ngznN> AVX Automotive MLCC <https://www.mouser.com/datasheet/2/40/AutoMLCC-777028.pdf> KEMET X7R Series <https://www.mouser.com/datasheet/2/212/KEM_C1002_X7R_SMD-1102033.pdf>; CAPACITANCE: 0.1µF; DKPN: 1276-1006-1-ND; MANUFACTURER: Samsung Electro-Mechanics; MOPN: 187-CL10B104KA8NNNC; MPN: CL10B104KA8NNNC; TOLERANCE: 10%; VOLTAGE: 25V
C17-C22 C103 C107 = HyTechDevices:CAPACITOR_?_*: Capacitor, Non-Polarized VJ...1BC Series Datasheet <https://www.mouser.com/datasheet/2/427/vjw1bcbascomseries-1762447.pdf> Samsung Datasheet <https://www.mouser.com/datasheet/2/585/MLCC-1837944.pdf> Walsin Datasheet <https://www.mouser.com/datasheet/2/210/WTC_MLCC_General_Purpose-1534899.pdf> GRM188R61A226ME15D <https://www.mouser.com/datasheet/2/281/1/GRM188R61A226ME15_02A-1985787.pdf> GRM188R61E106MA73D <https://www.mouser.com/datasheet/2/281/1/GRM188R61E106MA73_01A-1985806.pdf> 885012006013 <https://www.mouser.com/datasheet/2/445/885012006013-1726946.pdf> 2220Y6300105KXTWS2 <https://www.mouser.com/datasheet/2/218/SMD_High_and_Std_StackiCap_P62-1825512.pdf> Yageo Class 2, X5R <https://www.mouser.com/datasheet/2/447/UPY_GPHC_X5R_4V_to_50V_26-1827097.pdf> TDK C Series <https://www.mouser.com/ProductDetail/TDK/C3216X5R1V226M160AC?qs=%2Fha2pyFadujbcx9jh7lYl%2F4NeMoXFhdc8AqVWNq4wW6M2y7zl6GzBuhgtI0ngznN> AVX Automotive MLCC <https://www.mouser.com/datasheet/2/40/AutoMLCC-777028.pdf> KEMET X7R Series <https://www.mouser.com/datasheet/2/212/KEM_C1002_X7R_SMD-1102033.pdf>; CAPACITANCE: 1µF; DKPN: 311-1796-1-ND; MANUFACTURER: Yageo; MOPN: 603-CC603KRX7R6BB105; MPN: CC0603KRX7R6BB105; TOLERANCE: 10%; VOLTAGE: 10V
C23 C102 C105 C106 C108 = HyTechDevices:CAPACITOR_?_*: Capacitor, Non-Polarized VJ...1BC Series Datasheet <https://www.mouser.com/datasheet/2/427/vjw1bcbascomseries-1762447.pdf> Samsung Datasheet <https://www.mouser.com/datasheet/2/585/MLCC-1837944.pdf> Walsin Datasheet <https://www.mouser.com/datasheet/2/210/WTC_MLCC_General_Purpose-1534899.pdf> GRM188R61A226ME15D <https://www.mouser.com/datasheet/2/281/1/GRM188R61A226ME15_02A-1985787.pdf> GRM188R61E106MA73D <https://www.mouser.com/datasheet/2/281/1/GRM188R61E106MA73_01A-1985806.pdf> 885012006013 <https://www.mouser.com/datasheet/2/445/885012006013-1726946.pdf> 2220Y6300105KXTWS2 <https://www.mouser.com/datasheet/2/218/SMD_High_and_Std_StackiCap_P62-1825512.pdf> Yageo Class 2, X5R <https://www.mouser.com/datasheet/2/447/UPY_GPHC_X5R_4V_to_50V_26-1827097.pdf> TDK C Series <https://www.mouser.com/ProductDetail/TDK/C3216X5R1V226M160AC?qs=%2Fha2pyFadujbcx9jh7lYl%2F4NeMoXFhdc8AqVWNq4wW6M2y7zl6GzBuhgtI0ngznN> AVX Automotive MLCC <https://www.mouser.com/datasheet/2/40/AutoMLCC-777028.pdf> KEMET X7R Series <https://www.mouser.com/datasheet/2/212/KEM_C1002_X7R_SMD-1102033.pdf>; CAPACITANCE: 0.1µF; DKPN: 720-1688-1-ND; MANUFACTURER: Vishay Vitramon; MOPN: 77-VJ0603Y104JXQPBC; MPN: VJ0603Y104JXQPW1BC; TOLERANCE: 5%; VOLTAGE: 10V
C101 = HyTechDevices:CAPACITOR_?_*: Capacitor, Non-Polarized VJ...1BC Series Datasheet <https://www.mouser.com/datasheet/2/427/vjw1bcbascomseries-1762447.pdf> Samsung Datasheet <https://www.mouser.com/datasheet/2/585/MLCC-1837944.pdf> Walsin Datasheet <https://www.mouser.com/datasheet/2/210/WTC_MLCC_General_Purpose-1534899.pdf> GRM188R61A226ME15D <https://www.mouser.com/datasheet/2/281/1/GRM188R61A226ME15_02A-1985787.pdf> GRM188R61E106MA73D <https://www.mouser.com/datasheet/2/281/1/GRM188R61E106MA73_01A-1985806.pdf> 885012006013 <https://www.mouser.com/datasheet/2/445/885012006013-1726946.pdf> 2220Y6300105KXTWS2 <https://www.mouser.com/datasheet/2/218/SMD_High_and_Std_StackiCap_P62-1825512.pdf> Yageo Class 2, X5R <https://www.mouser.com/datasheet/2/447/UPY_GPHC_X5R_4V_to_50V_26-1827097.pdf> TDK C Series <https://www.mouser.com/ProductDetail/TDK/C3216X5R1V226M160AC?qs=%2Fha2pyFadujbcx9jh7lYl%2F4NeMoXFhdc8AqVWNq4wW6M2y7zl6GzBuhgtI0ngznN> AVX Automotive MLCC <https://www.mouser.com/datasheet/2/40/AutoMLCC-777028.pdf> KEMET X7R Series <https://www.mouser.com/datasheet/2/212/KEM_C1002_X7R_SMD-1102033.pdf>; CAPACITANCE: 4.7µF; DKPN: 1276-1044-1-ND; MANUFACTURER: Samsung Electro-Mechanics; MOPN: 187-CL10A475KP8NNNC; MPN: CL10A475KP8NNNC; TOLERANCE: 10%; VOLTAGE: 10V
C110 = HyTechDevices:CAPACITOR_?_*: Capacitor, Non-Polarized VJ...1BC Series Datasheet <https://www.mouser.com/datasheet/2/427/vjw1bcbascomseries-1762447.pdf> Samsung Datasheet <https://www.mouser.com/datasheet/2/585/MLCC-1837944.pdf> Walsin Datasheet <https://www.mouser.com/datasheet/2/210/WTC_MLCC_General_Purpose-1534899.pdf> GRM188R61A226ME15D <https://www.mouser.com/datasheet/2/281/1/GRM188R61A226ME15_02A-1985787.pdf> GRM188R61E106MA73D <https://www.mouser.com/datasheet/2/281/1/GRM188R61E106MA73_01A-1985806.pdf> 885012006013 <https://www.mouser.com/datasheet/2/445/885012006013-1726946.pdf> 2220Y6300105KXTWS2 <https://www.mouser.com/datasheet/2/218/SMD_High_and_Std_StackiCap_P62-1825512.pdf> Yageo Class 2, X5R <https://www.mouser.com/datasheet/2/447/UPY_GPHC_X5R_4V_to_50V_26-1827097.pdf> TDK C Series <https://www.mouser.com/ProductDetail/TDK/C3216X5R1V226M160AC?qs=%2Fha2pyFadujbcx9jh7lYl%2F4NeMoXFhdc8AqVWNq4wW6M2y7zl6GzBuhgtI0ngznN> AVX Automotive MLCC <https://www.mouser.com/datasheet/2/40/AutoMLCC-777028.pdf> KEMET X7R Series <https://www.mouser.com/datasheet/2/212/KEM_C1002_X7R_SMD-1102033.pdf>; CAPACITANCE: 10µF; DKPN: 490-7202-1-ND; MANUFACTURER: Murata Electronics; MOPN: 81-GRM188R61E106MA3D; MPN: GRM188R61E106MA73D; TOLERANCE: 20%; VOLTAGE: 25V
C112 = HyTechDevices:CAPACITOR_?_*: Capacitor, Non-Polarized VJ...1BC Series Datasheet <https://www.mouser.com/datasheet/2/427/vjw1bcbascomseries-1762447.pdf> Samsung Datasheet <https://www.mouser.com/datasheet/2/585/MLCC-1837944.pdf> Walsin Datasheet <https://www.mouser.com/datasheet/2/210/WTC_MLCC_General_Purpose-1534899.pdf> GRM188R61A226ME15D <https://www.mouser.com/datasheet/2/281/1/GRM188R61A226ME15_02A-1985787.pdf> GRM188R61E106MA73D <https://www.mouser.com/datasheet/2/281/1/GRM188R61E106MA73_01A-1985806.pdf> 885012006013 <https://www.mouser.com/datasheet/2/445/885012006013-1726946.pdf> 2220Y6300105KXTWS2 <https://www.mouser.com/datasheet/2/218/SMD_High_and_Std_StackiCap_P62-1825512.pdf> Yageo Class 2, X5R <https://www.mouser.com/datasheet/2/447/UPY_GPHC_X5R_4V_to_50V_26-1827097.pdf> TDK C Series <https://www.mouser.com/ProductDetail/TDK/C3216X5R1V226M160AC?qs=%2Fha2pyFadujbcx9jh7lYl%2F4NeMoXFhdc8AqVWNq4wW6M2y7zl6GzBuhgtI0ngznN> AVX Automotive MLCC <https://www.mouser.com/datasheet/2/40/AutoMLCC-777028.pdf> KEMET X7R Series <https://www.mouser.com/datasheet/2/212/KEM_C1002_X7R_SMD-1102033.pdf>; CAPACITANCE: 0.1µF; DKPN: 587-3354-1-ND; MANUFACTURER: Taiyo Yuden; MOPN: 963-GMK107B7104KAHT; MPN: GMK107B7104KAHT; TOLERANCE: 10%; VOLTAGE: 35V
D1 D4 D6 D9 = HyTechDevices:LED_?_*: LED 0603 Blue <https://www.mouser.com/datasheet/2/216/APT1608VBC_D-246010.pdf> Green <https://www.mouser.com/datasheet/2/216/APT1608ZGCK-1173388.pdf> Orange <https://www.mouser.com/datasheet/2/216/APT1608SECK-6197.pdf> Red <https://www.mouser.com/datasheet/2/216/APT1608SECK-J3-PRV-1173336.pdf> White <https://www.mouser.com/datasheet/2/50/SM0603UWC-880813.pdf> Yellow <https://www.mouser.com/datasheet/2/216/APT1608SYCK-J3-PRV-1173311.pdf> 2835 (Series not on Digikey) Lumiled LUXEON 2835 Color Line <https://www.mouser.com/datasheet/2/602/DS236_luxeon_2835_color_line_datasheet-1596094.pdf>; COLOR: Blue; DKPN: 754-1789-1-ND; MANUFACTURER: Kingbright; MOPN: 604-APT1608VBC/D; MPN: APT1608VBC/D
D2 = HyTechDevices:LED_?_*: LED 0603 Blue <https://www.mouser.com/datasheet/2/216/APT1608VBC_D-246010.pdf> Green <https://www.mouser.com/datasheet/2/216/APT1608ZGCK-1173388.pdf> Orange <https://www.mouser.com/datasheet/2/216/APT1608SECK-6197.pdf> Red <https://www.mouser.com/datasheet/2/216/APT1608SECK-J3-PRV-1173336.pdf> White <https://www.mouser.com/datasheet/2/50/SM0603UWC-880813.pdf> Yellow <https://www.mouser.com/datasheet/2/216/APT1608SYCK-J3-PRV-1173311.pdf> 2835 (Series not on Digikey) Lumiled LUXEON 2835 Color Line <https://www.mouser.com/datasheet/2/602/DS236_luxeon_2835_color_line_datasheet-1596094.pdf>; COLOR: Red; DKPN: 754-1786-1-ND; MANUFACTURER: Kingbright; MOPN: 604-APT1608SECKJ3PRV; MPN: APT1608SECK/J3-PRV
D3 D100 D101 = HyTechDevices:SCHOTTKY_?_*: CUS08F30 Shottky Diode Datasheet <https://www.mouser.com/datasheet/2/408/CUS08F30_datasheet_en_20140414-1916097.pdf>; CURRENT: 0.8A; DKPN: CUS08F30H3FTR-ND; MANUFACTURER: Toshiba Semiconductor and Storage; MOPN: 757-CUS08F30H3F; MPN: CUS08F30; VOLTAGE: 30V
D5 = HyTechDevices:TVS_*: TVS Diode GSOT Datasheet <https://www.mouser.com/datasheet/2/427/gsot03-1767593.pdf>; DKPN: GSOT08-E3-08TR-ND; MANUFACTURER: Vishay General Semiconductor - Diodes Division; MOPN: 78-GSOT08-E3-08; MPN: GSOT08-E3-08; VOLTAGE: 8V
D7 = HyTechDevices:LED_?_*: LED 0603 Blue <https://www.mouser.com/datasheet/2/216/APT1608VBC_D-246010.pdf> Green <https://www.mouser.com/datasheet/2/216/APT1608ZGCK-1173388.pdf> Orange <https://www.mouser.com/datasheet/2/216/APT1608SECK-6197.pdf> Red <https://www.mouser.com/datasheet/2/216/APT1608SECK-J3-PRV-1173336.pdf> White <https://www.mouser.com/datasheet/2/50/SM0603UWC-880813.pdf> Yellow <https://www.mouser.com/datasheet/2/216/APT1608SYCK-J3-PRV-1173311.pdf> 2835 (Series not on Digikey) Lumiled LUXEON 2835 Color Line <https://www.mouser.com/datasheet/2/602/DS236_luxeon_2835_color_line_datasheet-1596094.pdf>; COLOR: White; DKPN: SM0603UWC-ND; MANUFACTURER: Bivar Inc.; MOPN: 749-SM0603UWC; MPN: SM0603UWC
D8 = HyTechDevices:LED_?_*: LED 0603 Blue <https://www.mouser.com/datasheet/2/216/APT1608VBC_D-246010.pdf> Green <https://www.mouser.com/datasheet/2/216/APT1608ZGCK-1173388.pdf> Orange <https://www.mouser.com/datasheet/2/216/APT1608SECK-6197.pdf> Red <https://www.mouser.com/datasheet/2/216/APT1608SECK-J3-PRV-1173336.pdf> White <https://www.mouser.com/datasheet/2/50/SM0603UWC-880813.pdf> Yellow <https://www.mouser.com/datasheet/2/216/APT1608SYCK-J3-PRV-1173311.pdf> 2835 (Series not on Digikey) Lumiled LUXEON 2835 Color Line <https://www.mouser.com/datasheet/2/602/DS236_luxeon_2835_color_line_datasheet-1596094.pdf>; COLOR: Yellow; DKPN: 754-1788-1-ND; MANUFACTURER: Kingbright; MOPN: 604-APT1608SYCK/J3-PRV; MPN: APT1608SYCK/J3-PRV
D10 = HyTechDevices:LED_?_*: LED 0603 Blue <https://www.mouser.com/datasheet/2/216/APT1608VBC_D-246010.pdf> Green <https://www.mouser.com/datasheet/2/216/APT1608ZGCK-1173388.pdf> Orange <https://www.mouser.com/datasheet/2/216/APT1608SECK-6197.pdf> Red <https://www.mouser.com/datasheet/2/216/APT1608SECK-J3-PRV-1173336.pdf> White <https://www.mouser.com/datasheet/2/50/SM0603UWC-880813.pdf> Yellow <https://www.mouser.com/datasheet/2/216/APT1608SYCK-J3-PRV-1173311.pdf> 2835 (Series not on Digikey) Lumiled LUXEON 2835 Color Line <https://www.mouser.com/datasheet/2/602/DS236_luxeon_2835_color_line_datasheet-1596094.pdf>; COLOR: Green; DKPN: 754-1790-1-ND; MANUFACTURER: Kingbright; MOPN: 604-APT1608ZGCK; MPN: APT1608ZGCK
D11 = HyTechDevices:LED_?_*: LED 0603 Blue <https://www.mouser.com/datasheet/2/216/APT1608VBC_D-246010.pdf> Green <https://www.mouser.com/datasheet/2/216/APT1608ZGCK-1173388.pdf> Orange <https://www.mouser.com/datasheet/2/216/APT1608SECK-6197.pdf> Red <https://www.mouser.com/datasheet/2/216/APT1608SECK-J3-PRV-1173336.pdf> White <https://www.mouser.com/datasheet/2/50/SM0603UWC-880813.pdf> Yellow <https://www.mouser.com/datasheet/2/216/APT1608SYCK-J3-PRV-1173311.pdf> 2835 (Series not on Digikey) Lumiled LUXEON 2835 Color Line <https://www.mouser.com/datasheet/2/602/DS236_luxeon_2835_color_line_datasheet-1596094.pdf>; COLOR: Orange; DKPN: 754-1120-1-ND; MANUFACTURER: Kingbright; MOPN: 604-APT1608SECK; MPN: APT1608SECK
D102 = HyTechDevicesTempTSB:RECTIFIER_*_?; CURRENT: 1A; DKPN: US1GWF-7DITR-ND; MANUFACTURER: Diodes Incorporated; MOPN: 621-US1GWF-7; MPN: US1GWF-7; VOLTAGE: 400V
F1 F2 = HyTechDevices:FUSE_?_*: Fuse 0885 Series <https://www.mouser.com/datasheet/2/240/Littelfuse_Fuse_885_Datasheet_pdf-1371443.pdf>; CURRENT: 1.25A; DKPN: F10986CT-ND; MANUFACTURER: Littelfuse Inc.; MOPN: 576-08851.25DR; MPN: 08851.25DR; VOLTAGE: 500V
J1 = HyTechDevices:CONNECTOR-4_?_*; MANUFACTURER: Molex; MPN: 2068320423
J2 = HyTechDevices:CONNECTOR-5_?_*; MANUFACTURER: Molex; MPN: 2165713006
J3 = HyTechDevices:CONNECTOR-5_?_*; MANUFACTURER: Molex; MPN: 2165713007
J4 = HyTechDevices:CONNECTOR-8_?_*: 8 Pin Connector; DKPN: S7107-ND; MANUFACTURER: Sullins Connector Solutions; MPN: PPPC042LFBN-RC
K1 = HyTechDevices:RELAY_SPST_NO_?*: Single Pole, Single Throw Relay Normally Open 355x Series <https://www.comus-intl.com/wp-content/uploads/2017/01/High-Voltage-Reed-Relays.pdf> D Series <https://www.mouser.com/datasheet/2/657/cynergy3_d_pcb_v2-1892244.pdf>; DKPN: 1835-1037-ND; MANUFACTURER: Comus International; MPN: 3350-1275-126
K2 = HyTechDevices:RELAY_SPST_NC_POLARIZED_?*: Single Pole, Single Throw Normally Closed Polarized Relay 355x Series <https://www.comus-intl.com/wp-content/uploads/2017/01/High-Voltage-Reed-Relays.pdf> D Series <https://www.mouser.com/datasheet/2/657/cynergy3_d_pcb_v2-1892244.pdf>; DKPN: 1835-1040-ND; MANUFACTURER: Comus International; MPN: 3350-4275-126
K3 = HyTechDevicesTempTSB:RELAY_SOLIDSTATE_NO_*: Normally Open Solid-State Relay Datasheet <file:///C:/Users/kamin/Downloads/semi_eng_ge1a_aqy21_e.pdf>; DKPN: 255-1436-5-ND; MANUFACTURER: Panasonic Inustrial Devices; MOPN: 769-AQY214EHA; MPN: AQY214EHA
K100 = HyTechDevicesTempTSB:RELAY_SOLIDSTATE_NC_*: Normally Closed Solid-State Relay Datasheet <file:///C:/Users/kamin/Downloads/semi_eng_ge1b_aqy41_e%20(1).pdf>; DKPN: 255-2897-ND; MANUFACTURER: Panasonic Industrial Devices; MOPN: 769-AQY414EHA; MPN: AQY414EHA
L1 = HyTechDevices:INDUCTOR_?_*: Inductor LQM18DH100M70 Datasheet <https://search.murata.co.jp/Ceramy/image/img/P02/JELF243B-9127.pdf> 74451133 Datasheet <https://www.we-online.com/catalog/datasheet/74451133.pdf> SRU1408 Datasheet <https://www.mouser.com/datasheet/2/54/SRU1048-1391431.pdf> PA4334 Datasheet <https://www.mouser.com/datasheet/2/336/plei_s_a0002827602_1-2281222.pdf> WE-LMHI Datasheet <https://www.mouser.com/datasheet/2/445/74437349560-1721693.pdf>; CURRENT_RATED: 1.6A; CURRENT_SATURATION: 1A; DCR: 0.13Ω; DKPN: 553-3508-2-ND; INDUCTANCE: 3.6µH; MANUFACTURER: Pulse Electonics Company; MOPN: 673-PA4334362NLT; MPN: PA4334.362NLT
L2 = HyTechDevices:INDUCTOR_?_*: Inductor LQM18DH100M70 Datasheet <https://search.murata.co.jp/Ceramy/image/img/P02/JELF243B-9127.pdf> 74451133 Datasheet <https://www.we-online.com/catalog/datasheet/74451133.pdf> SRU1408 Datasheet <https://www.mouser.com/datasheet/2/54/SRU1048-1391431.pdf> PA4334 Datasheet <https://www.mouser.com/datasheet/2/336/plei_s_a0002827602_1-2281222.pdf> WE-LMHI Datasheet <https://www.mouser.com/datasheet/2/445/74437349560-1721693.pdf>; CURRENT_RATED: 1.4A; CURRENT_SATURATION: 2A; DCR: 342mΩ; DKPN: 732-11454-2-ND; INDUCTANCE: 56µH; MANUFACTURER: Wurth Elektronik; MOPN: 710-74437349560; MPN: 74437349560; TOLERANCE: 20%
L3 = HyTechDevices:INDUCTOR_?_*: Inductor LQM18DH100M70 Datasheet <https://search.murata.co.jp/Ceramy/image/img/P02/JELF243B-9127.pdf> 74451133 Datasheet <https://www.we-online.com/catalog/datasheet/74451133.pdf> SRU1408 Datasheet <https://www.mouser.com/datasheet/2/54/SRU1048-1391431.pdf> PA4334 Datasheet <https://www.mouser.com/datasheet/2/336/plei_s_a0002827602_1-2281222.pdf> WE-LMHI Datasheet <https://www.mouser.com/datasheet/2/445/74437349560-1721693.pdf>; CURRENT_RATED: 0.65A; CURRENT_SATURATION: 0.52A; DCR: 0.640Ω; DKPN: SRU1048-331YTR-ND; INDUCTANCE: 330µH; MANUFACTURER: Bourns Inc.; MOPN: 652-SRU1048-331Y; MPN: SRU1048-331Y; TOLERANCE: 30%
Q1 = HyTechDevices:TRANSISTOR_N_MOS_?_*: N-MOSFET PMV15ENEA Datasheet <https://www.mouser.com/datasheet/2/916/PMV15ENEA-1604828.pdf> TK6P65W Datasheet <https://www.mouser.com/datasheet/2/408/TK6P65W_datasheet_en_20151225-1916290.pdf> SIR638ADP Datasheet <https://www.mouser.com/datasheet/2/427/sir638adp-1766131.pdf>; DKPN: 1727-8588-1-ND; MANUFACTURER: Nexperia USA Inc.; MOPN: 771-PMV15ENEAR; MPN: PMV15ENEAR
R1 R4 R6 R25-R31 R106 = HyTechDevices:RESISTOR_?_*: Resistor PWR163 Series <https://www.mouser.com/datasheet/2/54/pwr163-777985.pdf> AC Series <https://www.mouser.com/datasheet/2/447/Yageo_PYu_AC_51_RoHS_L_7_1714230-1874691.pdf> PU Series <https://www.mouser.com/datasheet/2/447/PYu-PU_51_RoHS_L_6-1504619.pdf> ERA Series <https://www.mouser.com/datasheet/2/315/AOA0000C307-1149632.pdf> PWR263 Series <https://www.mouser.com/datasheet/2/54/pwr263s_35-778069.pdf> KTR Series <https://www.mouser.com/datasheet/2/348/ROHM_S_A0011075115_1-2563276.pdf> RC Series <https://www.mouser.com/datasheet/2/447/Yageo_03_18_2021_PYu_RC_Group_51_RoHS_L_11-2199992.pdf> ERJ PB3, PB6 Series <https://www.mouser.com/datasheet/2/315/AOA0000C328-1530132.pdf> ERJ PA2, P03, PA3, P06, P08, P14 Series <https://www.mouser.com/datasheet/2/315/AOA0000C331-1141874.pdf> B20 Series <https://www.ohmite.com/assets/docs/res_200.pdf?r=false>; DKPN: 311-1.00KHRCT-ND; MANUFACTURER: Yageo; MOPN: 603-RC0603FR-071KL; MPN: RC0603FR-071KL; POWER: 0.1W; RESISTANCE: 1k; TOLERANCE: 1%; VOLTAGE_CONTINUOUS: 10.00V; VOLTAGE_MAX: 75V
R2 R22 = HyTechDevices:RESISTOR_?_*: Resistor PWR163 Series <https://www.mouser.com/datasheet/2/54/pwr163-777985.pdf> AC Series <https://www.mouser.com/datasheet/2/447/Yageo_PYu_AC_51_RoHS_L_7_1714230-1874691.pdf> PU Series <https://www.mouser.com/datasheet/2/447/PYu-PU_51_RoHS_L_6-1504619.pdf> ERA Series <https://www.mouser.com/datasheet/2/315/AOA0000C307-1149632.pdf> PWR263 Series <https://www.mouser.com/datasheet/2/54/pwr263s_35-778069.pdf> KTR Series <https://www.mouser.com/datasheet/2/348/ROHM_S_A0011075115_1-2563276.pdf> RC Series <https://www.mouser.com/datasheet/2/447/Yageo_03_18_2021_PYu_RC_Group_51_RoHS_L_11-2199992.pdf> ERJ PB3, PB6 Series <https://www.mouser.com/datasheet/2/315/AOA0000C328-1530132.pdf> ERJ PA2, P03, PA3, P06, P08, P14 Series <https://www.mouser.com/datasheet/2/315/AOA0000C331-1141874.pdf> B20 Series <https://www.ohmite.com/assets/docs/res_200.pdf?r=false>; DKPN: 13-RT0603BRD0739RLTR-ND; MANUFACTURER: Yageo; MOPN: 603-RT0603BRD0739RL; MPN: RT0603BRD0739RL; POWER: 0.1W; RESISTANCE: 39; TOLERANCE: 1%; VOLTAGE_MAX: 75V
R3 = HyTechDevices:RESISTOR_?_*: Resistor PWR163 Series <https://www.mouser.com/datasheet/2/54/pwr163-777985.pdf> AC Series <https://www.mouser.com/datasheet/2/447/Yageo_PYu_AC_51_RoHS_L_7_1714230-1874691.pdf> PU Series <https://www.mouser.com/datasheet/2/447/PYu-PU_51_RoHS_L_6-1504619.pdf> ERA Series <https://www.mouser.com/datasheet/2/315/AOA0000C307-1149632.pdf> PWR263 Series <https://www.mouser.com/datasheet/2/54/pwr263s_35-778069.pdf> KTR Series <https://www.mouser.com/datasheet/2/348/ROHM_S_A0011075115_1-2563276.pdf> RC Series <https://www.mouser.com/datasheet/2/447/Yageo_03_18_2021_PYu_RC_Group_51_RoHS_L_11-2199992.pdf> ERJ PB3, PB6 Series <https://www.mouser.com/datasheet/2/315/AOA0000C328-1530132.pdf> ERJ PA2, P03, PA3, P06, P08, P14 Series <https://www.mouser.com/datasheet/2/315/AOA0000C331-1141874.pdf> B20 Series <https://www.ohmite.com/assets/docs/res_200.pdf?r=false>; DKPN: 1712-CPF0603B1R62E1TR-ND; MANUFACTURER: TE Conductivity Passive Product; MOPN: 279-CPF0603B1R62E1; MPN: CPF0603B1R62E1; POWER: 0.1W; RESISTANCE: 1.62; TOLERANCE: 0.1%; VOLTAGE_CONTINUOUS: 0.51V; VOLTAGE_MAX: 50V
R5 R23 = HyTechDevices:RESISTOR_?_*: Resistor PWR163 Series <https://www.mouser.com/datasheet/2/54/pwr163-777985.pdf> AC Series <https://www.mouser.com/datasheet/2/447/Yageo_PYu_AC_51_RoHS_L_7_1714230-1874691.pdf> PU Series <https://www.mouser.com/datasheet/2/447/PYu-PU_51_RoHS_L_6-1504619.pdf> ERA Series <https://www.mouser.com/datasheet/2/315/AOA0000C307-1149632.pdf> PWR263 Series <https://www.mouser.com/datasheet/2/54/pwr263s_35-778069.pdf> KTR Series <https://www.mouser.com/datasheet/2/348/ROHM_S_A0011075115_1-2563276.pdf> RC Series <https://www.mouser.com/datasheet/2/447/Yageo_03_18_2021_PYu_RC_Group_51_RoHS_L_11-2199992.pdf> ERJ PB3, PB6 Series <https://www.mouser.com/datasheet/2/315/AOA0000C328-1530132.pdf> ERJ PA2, P03, PA3, P06, P08, P14 Series <https://www.mouser.com/datasheet/2/315/AOA0000C331-1141874.pdf> B20 Series <https://www.ohmite.com/assets/docs/res_200.pdf?r=false>; DKPN: 311-10.0KHRCT-ND; MANUFACTURER: Yageo; MOPN: 603-RC0603FR-0710KL; MPN: RC0603FR-0710KL; POWER: 0.1W; RESISTANCE: 10k; TOLERANCE: 1%; VOLTAGE_CONTINUOUS: 31.62V; VOLTAGE_MAX: 75V
R7 R8 R13 = HyTechDevices:RESISTOR_?_*: Resistor PWR163 Series <https://www.mouser.com/datasheet/2/54/pwr163-777985.pdf> AC Series <https://www.mouser.com/datasheet/2/447/Yageo_PYu_AC_51_RoHS_L_7_1714230-1874691.pdf> PU Series <https://www.mouser.com/datasheet/2/447/PYu-PU_51_RoHS_L_6-1504619.pdf> ERA Series <https://www.mouser.com/datasheet/2/315/AOA0000C307-1149632.pdf> PWR263 Series <https://www.mouser.com/datasheet/2/54/pwr263s_35-778069.pdf> KTR Series <https://www.mouser.com/datasheet/2/348/ROHM_S_A0011075115_1-2563276.pdf> RC Series <https://www.mouser.com/datasheet/2/447/Yageo_03_18_2021_PYu_RC_Group_51_RoHS_L_11-2199992.pdf> ERJ PB3, PB6 Series <https://www.mouser.com/datasheet/2/315/AOA0000C328-1530132.pdf> ERJ PA2, P03, PA3, P06, P08, P14 Series <https://www.mouser.com/datasheet/2/315/AOA0000C331-1141874.pdf> B20 Series <https://www.ohmite.com/assets/docs/res_200.pdf?r=false>; DKPN: B20J10KE-ND; MANUFACTURER: Ohmite; MOPN: 588-B20J10KE; MPN: B20J10KE; POWER: 20W; RESISTANCE: 10k; TOLERANCE: 5%; VOLTAGE_CONTINUOUS: 447V; VOLTAGE_MAX: 750V
R9 = HyTechDevices:RESISTOR_?_*: Resistor PWR163 Series <https://www.mouser.com/datasheet/2/54/pwr163-777985.pdf> AC Series <https://www.mouser.com/datasheet/2/447/Yageo_PYu_AC_51_RoHS_L_7_1714230-1874691.pdf> PU Series <https://www.mouser.com/datasheet/2/447/PYu-PU_51_RoHS_L_6-1504619.pdf> ERA Series <https://www.mouser.com/datasheet/2/315/AOA0000C307-1149632.pdf> PWR263 Series <https://www.mouser.com/datasheet/2/54/pwr263s_35-778069.pdf> KTR Series <https://www.mouser.com/datasheet/2/348/ROHM_S_A0011075115_1-2563276.pdf> RC Series <https://www.mouser.com/datasheet/2/447/Yageo_03_18_2021_PYu_RC_Group_51_RoHS_L_11-2199992.pdf> ERJ PB3, PB6 Series <https://www.mouser.com/datasheet/2/315/AOA0000C328-1530132.pdf> ERJ PA2, P03, PA3, P06, P08, P14 Series <https://www.mouser.com/datasheet/2/315/AOA0000C331-1141874.pdf> B20 Series <https://www.ohmite.com/assets/docs/res_200.pdf?r=false>; DKPN: 311-180HRCT-ND; MANUFACTURER: Yageo; MOPN: 603-RC0603FR-07180RL; MPN: RC0603FR-07180RL; POWER: 0.1W; RESISTANCE: 180; TOLERANCE: 1%; VOLTAGE_CONTINUOUS: 4.24V; VOLTAGE_MAX: 75V
R10 = HyTechDevices:RESISTOR_?_*: Resistor PWR163 Series <https://www.mouser.com/datasheet/2/54/pwr163-777985.pdf> AC Series <https://www.mouser.com/datasheet/2/447/Yageo_PYu_AC_51_RoHS_L_7_1714230-1874691.pdf> PU Series <https://www.mouser.com/datasheet/2/447/PYu-PU_51_RoHS_L_6-1504619.pdf> ERA Series <https://www.mouser.com/datasheet/2/315/AOA0000C307-1149632.pdf> PWR263 Series <https://www.mouser.com/datasheet/2/54/pwr263s_35-778069.pdf> KTR Series <https://www.mouser.com/datasheet/2/348/ROHM_S_A0011075115_1-2563276.pdf> RC Series <https://www.mouser.com/datasheet/2/447/Yageo_03_18_2021_PYu_RC_Group_51_RoHS_L_11-2199992.pdf> ERJ PB3, PB6 Series <https://www.mouser.com/datasheet/2/315/AOA0000C328-1530132.pdf> ERJ PA2, P03, PA3, P06, P08, P14 Series <https://www.mouser.com/datasheet/2/315/AOA0000C331-1141874.pdf> B20 Series <https://www.ohmite.com/assets/docs/res_200.pdf?r=false>; DKPN: B20J750E-ND; MANUFACTURER: Ohmite; MOPN: 588-B20J750E; MPN: B20J750E; POWER: 20W; RESISTANCE: 750; TOLERANCE: 5%; VOLTAGE_CONTINUOUS: 122V; VOLTAGE_MAX: 750V
R11 R12 = HyTechDevices:RESISTOR_?_*: Resistor PWR163 Series <https://www.mouser.com/datasheet/2/54/pwr163-777985.pdf> AC Series <https://www.mouser.com/datasheet/2/447/Yageo_PYu_AC_51_RoHS_L_7_1714230-1874691.pdf> PU Series <https://www.mouser.com/datasheet/2/447/PYu-PU_51_RoHS_L_6-1504619.pdf> ERA Series <https://www.mouser.com/datasheet/2/315/AOA0000C307-1149632.pdf> PWR263 Series <https://www.mouser.com/datasheet/2/54/pwr263s_35-778069.pdf> KTR Series <https://www.mouser.com/datasheet/2/348/ROHM_S_A0011075115_1-2563276.pdf> RC Series <https://www.mouser.com/datasheet/2/447/Yageo_03_18_2021_PYu_RC_Group_51_RoHS_L_11-2199992.pdf> ERJ PB3, PB6 Series <https://www.mouser.com/datasheet/2/315/AOA0000C328-1530132.pdf> ERJ PA2, P03, PA3, P06, P08, P14 Series <https://www.mouser.com/datasheet/2/315/AOA0000C331-1141874.pdf> B20 Series <https://www.ohmite.com/assets/docs/res_200.pdf?r=false>; DKPN: RHM75KAYTR-ND; MANUFACTURER: Rohm; MOPN: 755-KTR03EZPF7502; MPN: KTR03EZPF7502; POWER: 0.1W; RESISTANCE: 750k; TOLERANCE: 1%; VOLTAGE_MAX: 350V
R14 R15 = HyTechDevices:RESISTOR_?_*: Resistor PWR163 Series <https://www.mouser.com/datasheet/2/54/pwr163-777985.pdf> AC Series <https://www.mouser.com/datasheet/2/447/Yageo_PYu_AC_51_RoHS_L_7_1714230-1874691.pdf> PU Series <https://www.mouser.com/datasheet/2/447/PYu-PU_51_RoHS_L_6-1504619.pdf> ERA Series <https://www.mouser.com/datasheet/2/315/AOA0000C307-1149632.pdf> PWR263 Series <https://www.mouser.com/datasheet/2/54/pwr263s_35-778069.pdf> KTR Series <https://www.mouser.com/datasheet/2/348/ROHM_S_A0011075115_1-2563276.pdf> RC Series <https://www.mouser.com/datasheet/2/447/Yageo_03_18_2021_PYu_RC_Group_51_RoHS_L_11-2199992.pdf> ERJ PB3, PB6 Series <https://www.mouser.com/datasheet/2/315/AOA0000C328-1530132.pdf> ERJ PA2, P03, PA3, P06, P08, P14 Series <https://www.mouser.com/datasheet/2/315/AOA0000C331-1141874.pdf> B20 Series <https://www.ohmite.com/assets/docs/res_200.pdf?r=false>; DKPN: RHM360KAYTR-ND; MANUFACTURER: Rohm Semiconductor; MOPN: 755-KTR03EZPF3603; MPN: KTR03EZPF3603; POWER: 0.1W; RESISTANCE: 360k; TOLERANCE: 1%; VOLTAGE_CONTINUOUS: 189.74V; VOLTAGE_MAX: 350V
R16-R19 = HyTechDevices:RESISTOR_?_*: Resistor PWR163 Series <https://www.mouser.com/datasheet/2/54/pwr163-777985.pdf> AC Series <https://www.mouser.com/datasheet/2/447/Yageo_PYu_AC_51_RoHS_L_7_1714230-1874691.pdf> PU Series <https://www.mouser.com/datasheet/2/447/PYu-PU_51_RoHS_L_6-1504619.pdf> ERA Series <https://www.mouser.com/datasheet/2/315/AOA0000C307-1149632.pdf> PWR263 Series <https://www.mouser.com/datasheet/2/54/pwr263s_35-778069.pdf> KTR Series <https://www.mouser.com/datasheet/2/348/ROHM_S_A0011075115_1-2563276.pdf> RC Series <https://www.mouser.com/datasheet/2/447/Yageo_03_18_2021_PYu_RC_Group_51_RoHS_L_11-2199992.pdf> ERJ PB3, PB6 Series <https://www.mouser.com/datasheet/2/315/AOA0000C328-1530132.pdf> ERJ PA2, P03, PA3, P06, P08, P14 Series <https://www.mouser.com/datasheet/2/315/AOA0000C331-1141874.pdf> B20 Series <https://www.ohmite.com/assets/docs/res_200.pdf?r=false>; DKPN: RHM750KAYTR-ND; MANUFACTURER: Rohm; MOPN: 755-KTR03EZPF7503; MPN: KTR03EZPF7503; POWER: 0.1W; RESISTANCE: 75k; TOLERANCE: 1%; VOLTAGE_MAX: 350V
R20 R21 = HyTechDevices:RESISTOR_?_*: Resistor PWR163 Series <https://www.mouser.com/datasheet/2/54/pwr163-777985.pdf> AC Series <https://www.mouser.com/datasheet/2/447/Yageo_PYu_AC_51_RoHS_L_7_1714230-1874691.pdf> PU Series <https://www.mouser.com/datasheet/2/447/PYu-PU_51_RoHS_L_6-1504619.pdf> ERA Series <https://www.mouser.com/datasheet/2/315/AOA0000C307-1149632.pdf> PWR263 Series <https://www.mouser.com/datasheet/2/54/pwr263s_35-778069.pdf> KTR Series <https://www.mouser.com/datasheet/2/348/ROHM_S_A0011075115_1-2563276.pdf> RC Series <https://www.mouser.com/datasheet/2/447/Yageo_03_18_2021_PYu_RC_Group_51_RoHS_L_11-2199992.pdf> ERJ PB3, PB6 Series <https://www.mouser.com/datasheet/2/315/AOA0000C328-1530132.pdf> ERJ PA2, P03, PA3, P06, P08, P14 Series <https://www.mouser.com/datasheet/2/315/AOA0000C331-1141874.pdf> B20 Series <https://www.ohmite.com/assets/docs/res_200.pdf?r=false>; DKPN: P20144TR-ND; MANUFACTURER: Panasonic Electronic Components; MOPN: 667-ERJ-PB3B3322V; MPN: ERJ-PB3B3322V; POWER: 0.1W; RESISTANCE: 33.2k; TOLERANCE: 0.1%; VOLTAGE_CONTINUOUS: 57.61V; VOLTAGE_MAX: 75V
R24 = HyTechDevices:RESISTOR_?_*: Resistor PWR163 Series <https://www.mouser.com/datasheet/2/54/pwr163-777985.pdf> AC Series <https://www.mouser.com/datasheet/2/447/Yageo_PYu_AC_51_RoHS_L_7_1714230-1874691.pdf> PU Series <https://www.mouser.com/datasheet/2/447/PYu-PU_51_RoHS_L_6-1504619.pdf> ERA Series <https://www.mouser.com/datasheet/2/315/AOA0000C307-1149632.pdf> PWR263 Series <https://www.mouser.com/datasheet/2/54/pwr263s_35-778069.pdf> KTR Series <https://www.mouser.com/datasheet/2/348/ROHM_S_A0011075115_1-2563276.pdf> RC Series <https://www.mouser.com/datasheet/2/447/Yageo_03_18_2021_PYu_RC_Group_51_RoHS_L_11-2199992.pdf> ERJ PB3, PB6 Series <https://www.mouser.com/datasheet/2/315/AOA0000C328-1530132.pdf> ERJ PA2, P03, PA3, P06, P08, P14 Series <https://www.mouser.com/datasheet/2/315/AOA0000C331-1141874.pdf> B20 Series <https://www.ohmite.com/assets/docs/res_200.pdf?r=false>; DKPN: 311-10.0HRCT-ND; MANUFACTURER: Yageo; MOPN: 603-RC0603FR-0710RL; MPN: RC0603FR-0710RL; POWER: 0.1W; RESISTANCE: 10; TOLERANCE: 1%; VOLTAGE_CONTINUOUS: 1.00V; VOLTAGE_MAX: 75V
R100 R103 = HyTechDevices:RESISTOR_?_*: Resistor PWR163 Series <https://www.mouser.com/datasheet/2/54/pwr163-777985.pdf> AC Series <https://www.mouser.com/datasheet/2/447/Yageo_PYu_AC_51_RoHS_L_7_1714230-1874691.pdf> PU Series <https://www.mouser.com/datasheet/2/447/PYu-PU_51_RoHS_L_6-1504619.pdf> ERA Series <https://www.mouser.com/datasheet/2/315/AOA0000C307-1149632.pdf> PWR263 Series <https://www.mouser.com/datasheet/2/54/pwr263s_35-778069.pdf> KTR Series <https://www.mouser.com/datasheet/2/348/ROHM_S_A0011075115_1-2563276.pdf> RC Series <https://www.mouser.com/datasheet/2/447/Yageo_03_18_2021_PYu_RC_Group_51_RoHS_L_11-2199992.pdf> ERJ PB3, PB6 Series <https://www.mouser.com/datasheet/2/315/AOA0000C328-1530132.pdf> ERJ PA2, P03, PA3, P06, P08, P14 Series <https://www.mouser.com/datasheet/2/315/AOA0000C331-1141874.pdf> B20 Series <https://www.ohmite.com/assets/docs/res_200.pdf?r=false>; DKPN: P20936TR-ND; MANUFACTURER: Panasonic Electronic Components; MOPN: 667-ERJ-PB6B1004V; MPN: ERJ-PB6B1004V; POWER: 0.25W; RESISTANCE: 1M; TOLERANCE: 0.1%; VOLTAGE_CONTINUOUS: 150V; VOLTAGE_MAX: 150V
R101 R104 R107 = HyTechDevices:RESISTOR_?_*: Resistor PWR163 Series <https://www.mouser.com/datasheet/2/54/pwr163-777985.pdf> AC Series <https://www.mouser.com/datasheet/2/447/Yageo_PYu_AC_51_RoHS_L_7_1714230-1874691.pdf> PU Series <https://www.mouser.com/datasheet/2/447/PYu-PU_51_RoHS_L_6-1504619.pdf> ERA Series <https://www.mouser.com/datasheet/2/315/AOA0000C307-1149632.pdf> PWR263 Series <https://www.mouser.com/datasheet/2/54/pwr263s_35-778069.pdf> KTR Series <https://www.mouser.com/datasheet/2/348/ROHM_S_A0011075115_1-2563276.pdf> RC Series <https://www.mouser.com/datasheet/2/447/Yageo_03_18_2021_PYu_RC_Group_51_RoHS_L_11-2199992.pdf> ERJ PB3, PB6 Series <https://www.mouser.com/datasheet/2/315/AOA0000C328-1530132.pdf> ERJ PA2, P03, PA3, P06, P08, P14 Series <https://www.mouser.com/datasheet/2/315/AOA0000C331-1141874.pdf> B20 Series <https://www.ohmite.com/assets/docs/res_200.pdf?r=false>; DKPN: RT0603BRE0775KL-ND; MANUFACTURER: Yageo; MOPN: 603-RT0603BRE0775KL; MPN: RT0603BRE0775KL; POWER: 0.1W; RESISTANCE: 75k; TOLERANCE: 0.1%; VOLTAGE_CONTINUOUS: 75V; VOLTAGE_MAX: 75V
R102 R105 = HyTechDevices:RESISTOR_?_*: Resistor PWR163 Series <https://www.mouser.com/datasheet/2/54/pwr163-777985.pdf> AC Series <https://www.mouser.com/datasheet/2/447/Yageo_PYu_AC_51_RoHS_L_7_1714230-1874691.pdf> PU Series <https://www.mouser.com/datasheet/2/447/PYu-PU_51_RoHS_L_6-1504619.pdf> ERA Series <https://www.mouser.com/datasheet/2/315/AOA0000C307-1149632.pdf> PWR263 Series <https://www.mouser.com/datasheet/2/54/pwr263s_35-778069.pdf> KTR Series <https://www.mouser.com/datasheet/2/348/ROHM_S_A0011075115_1-2563276.pdf> RC Series <https://www.mouser.com/datasheet/2/447/Yageo_03_18_2021_PYu_RC_Group_51_RoHS_L_11-2199992.pdf> ERJ PB3, PB6 Series <https://www.mouser.com/datasheet/2/315/AOA0000C328-1530132.pdf> ERJ PA2, P03, PA3, P06, P08, P14 Series <https://www.mouser.com/datasheet/2/315/AOA0000C331-1141874.pdf> B20 Series <https://www.ohmite.com/assets/docs/res_200.pdf?r=false>; DKPN: P20904TR-ND; MANUFACTURER: Panasonic Electronic Components; MOPN: 667-ERJ-PB6B5233V; MPN: ERJ-PB6B5233V; POWER: 0.25W; RESISTANCE: 523k; TOLERANCE: 0.1%; VOLTAGE_CONTINUOUS: 150V; VOLTAGE_MAX: 150V
R108 = HyTechDevices:RESISTOR_?_*: Resistor PWR163 Series <https://www.mouser.com/datasheet/2/54/pwr163-777985.pdf> AC Series <https://www.mouser.com/datasheet/2/447/Yageo_PYu_AC_51_RoHS_L_7_1714230-1874691.pdf> PU Series <https://www.mouser.com/datasheet/2/447/PYu-PU_51_RoHS_L_6-1504619.pdf> ERA Series <https://www.mouser.com/datasheet/2/315/AOA0000C307-1149632.pdf> PWR263 Series <https://www.mouser.com/datasheet/2/54/pwr263s_35-778069.pdf> KTR Series <https://www.mouser.com/datasheet/2/348/ROHM_S_A0011075115_1-2563276.pdf> RC Series <https://www.mouser.com/datasheet/2/447/Yageo_03_18_2021_PYu_RC_Group_51_RoHS_L_11-2199992.pdf> ERJ PB3, PB6 Series <https://www.mouser.com/datasheet/2/315/AOA0000C328-1530132.pdf> ERJ PA2, P03, PA3, P06, P08, P14 Series <https://www.mouser.com/datasheet/2/315/AOA0000C331-1141874.pdf> B20 Series <https://www.ohmite.com/assets/docs/res_200.pdf?r=false>; DKPN: 764-1461-2-ND; MANUFACTURER: Vishay Dale Thin Film; MOPN: 71-PTN0603E8351BST1; MPN: PTN0603E8351BST1; POWER: 0.15W; RESISTANCE: 8.35k; TOLERANCE: 0.1%; VOLTAGE_CONTINUOUS: 28.90V; VOLTAGE_MAX: 75V
R109 = HyTechDevices:RESISTOR_?_*: Resistor PWR163 Series <https://www.mouser.com/datasheet/2/54/pwr163-777985.pdf> AC Series <https://www.mouser.com/datasheet/2/447/Yageo_PYu_AC_51_RoHS_L_7_1714230-1874691.pdf> PU Series <https://www.mouser.com/datasheet/2/447/PYu-PU_51_RoHS_L_6-1504619.pdf> ERA Series <https://www.mouser.com/datasheet/2/315/AOA0000C307-1149632.pdf> PWR263 Series <https://www.mouser.com/datasheet/2/54/pwr263s_35-778069.pdf> KTR Series <https://www.mouser.com/datasheet/2/348/ROHM_S_A0011075115_1-2563276.pdf> RC Series <https://www.mouser.com/datasheet/2/447/Yageo_03_18_2021_PYu_RC_Group_51_RoHS_L_11-2199992.pdf> ERJ PB3, PB6 Series <https://www.mouser.com/datasheet/2/315/AOA0000C328-1530132.pdf> ERJ PA2, P03, PA3, P06, P08, P14 Series <https://www.mouser.com/datasheet/2/315/AOA0000C331-1141874.pdf> B20 Series <https://www.ohmite.com/assets/docs/res_200.pdf?r=false>; DKPN: P20099TR-ND; MANUFACTURER: Panasonic Electronic Components; MOPN: 667-ERJ-PB3B1332V; MPN: ERJ-PB3B1332V; POWER: 0.2W; RESISTANCE: 13.3k; TOLERANCE: 0.1%; VOLTAGE_MAX: 75k
R110 = HyTechDevices:RESISTOR_?_*: Resistor PWR163 Series <https://www.mouser.com/datasheet/2/54/pwr163-777985.pdf> AC Series <https://www.mouser.com/datasheet/2/447/Yageo_PYu_AC_51_RoHS_L_7_1714230-1874691.pdf> PU Series <https://www.mouser.com/datasheet/2/447/PYu-PU_51_RoHS_L_6-1504619.pdf> ERA Series <https://www.mouser.com/datasheet/2/315/AOA0000C307-1149632.pdf> PWR263 Series <https://www.mouser.com/datasheet/2/54/pwr263s_35-778069.pdf> KTR Series <https://www.mouser.com/datasheet/2/348/ROHM_S_A0011075115_1-2563276.pdf> RC Series <https://www.mouser.com/datasheet/2/447/Yageo_03_18_2021_PYu_RC_Group_51_RoHS_L_11-2199992.pdf> ERJ PB3, PB6 Series <https://www.mouser.com/datasheet/2/315/AOA0000C328-1530132.pdf> ERJ PA2, P03, PA3, P06, P08, P14 Series <https://www.mouser.com/datasheet/2/315/AOA0000C331-1141874.pdf> B20 Series <https://www.ohmite.com/assets/docs/res_200.pdf?r=false>; DKPN: P20935TR-ND; MANUFACTURER: Panasonic Electronic Components; MOPN: 667-ERJ-PB6B9763V; MPN: ERJ-PB6B9763V; POWER: 0.25W; RESISTANCE: 976k; TOLERANCE: 0.1%; VOLTAGE_CONTINUOUS: 150V; VOLTAGE_MAX: 150V
R111 = HyTechDevices:RESISTOR_?_*: Resistor PWR163 Series <https://www.mouser.com/datasheet/2/54/pwr163-777985.pdf> AC Series <https://www.mouser.com/datasheet/2/447/Yageo_PYu_AC_51_RoHS_L_7_1714230-1874691.pdf> PU Series <https://www.mouser.com/datasheet/2/447/PYu-PU_51_RoHS_L_6-1504619.pdf> ERA Series <https://www.mouser.com/datasheet/2/315/AOA0000C307-1149632.pdf> PWR263 Series <https://www.mouser.com/datasheet/2/54/pwr263s_35-778069.pdf> KTR Series <https://www.mouser.com/datasheet/2/348/ROHM_S_A0011075115_1-2563276.pdf> RC Series <https://www.mouser.com/datasheet/2/447/Yageo_03_18_2021_PYu_RC_Group_51_RoHS_L_11-2199992.pdf> ERJ PB3, PB6 Series <https://www.mouser.com/datasheet/2/315/AOA0000C328-1530132.pdf> ERJ PA2, P03, PA3, P06, P08, P14 Series <https://www.mouser.com/datasheet/2/315/AOA0000C331-1141874.pdf> B20 Series <https://www.ohmite.com/assets/docs/res_200.pdf?r=false>; RESISTANCE: DNP
R112 = HyTechDevices:RESISTOR_?_*: Resistor PWR163 Series <https://www.mouser.com/datasheet/2/54/pwr163-777985.pdf> AC Series <https://www.mouser.com/datasheet/2/447/Yageo_PYu_AC_51_RoHS_L_7_1714230-1874691.pdf> PU Series <https://www.mouser.com/datasheet/2/447/PYu-PU_51_RoHS_L_6-1504619.pdf> ERA Series <https://www.mouser.com/datasheet/2/315/AOA0000C307-1149632.pdf> PWR263 Series <https://www.mouser.com/datasheet/2/54/pwr263s_35-778069.pdf> KTR Series <https://www.mouser.com/datasheet/2/348/ROHM_S_A0011075115_1-2563276.pdf> RC Series <https://www.mouser.com/datasheet/2/447/Yageo_03_18_2021_PYu_RC_Group_51_RoHS_L_11-2199992.pdf> ERJ PB3, PB6 Series <https://www.mouser.com/datasheet/2/315/AOA0000C328-1530132.pdf> ERJ PA2, P03, PA3, P06, P08, P14 Series <https://www.mouser.com/datasheet/2/315/AOA0000C331-1141874.pdf> B20 Series <https://www.ohmite.com/assets/docs/res_200.pdf?r=false>; DKPN: RHM365KAHTR-ND; MANUFACTURER: Rohm; MOPN: 755-KTR10EZPF3653; MPN: KTR10EZPF3653; POWER: 0.125W; RESISTANCE: 365k; TOLERANCE: 1%; VOLTAGE_CONTINUOUS: 213V; VOLTAGE_MAX: 350V
R113 = HyTechDevices:RESISTOR_?_*: Resistor PWR163 Series <https://www.mouser.com/datasheet/2/54/pwr163-777985.pdf> AC Series <https://www.mouser.com/datasheet/2/447/Yageo_PYu_AC_51_RoHS_L_7_1714230-1874691.pdf> PU Series <https://www.mouser.com/datasheet/2/447/PYu-PU_51_RoHS_L_6-1504619.pdf> ERA Series <https://www.mouser.com/datasheet/2/315/AOA0000C307-1149632.pdf> PWR263 Series <https://www.mouser.com/datasheet/2/54/pwr263s_35-778069.pdf> KTR Series <https://www.mouser.com/datasheet/2/348/ROHM_S_A0011075115_1-2563276.pdf> RC Series <https://www.mouser.com/datasheet/2/447/Yageo_03_18_2021_PYu_RC_Group_51_RoHS_L_11-2199992.pdf> ERJ PB3, PB6 Series <https://www.mouser.com/datasheet/2/315/AOA0000C328-1530132.pdf> ERJ PA2, P03, PA3, P06, P08, P14 Series <https://www.mouser.com/datasheet/2/315/AOA0000C331-1141874.pdf> B20 Series <https://www.ohmite.com/assets/docs/res_200.pdf?r=false>; DKPN: YAG1651TR-ND; MANUFACTURER: Yageo; MOPN: 603-RT0603BRD073K32L; MPN: RT0603BRD073K32L; POWER: 0.1W; RESISTANCE: 3.32k; TOLERANCE: 0.1%; VOLTAGE_CONTINUOUS: 18.22V; VOLTAGE_MAX: 75V
TP1-TP22 = HyTechDevices:TEST_POINT: Test Point; DKPN: 36-5015CT-ND; MANUFACTURER: Keystone Electronics; MOPN: 534-5015; MPN: 5015
U1 = HyTechDevices:LTC3639: LTC3639 Datasheet <https://www.mouser.com/datasheet/2/609/3639fd-1271210.pdf>; DKPN: LTC3639EMSE#TRPBFTR-ND; MANUFACTURER: Analog Devices Inc.; MOPN: 584-LTC3639EMSETRPBF; MPN: LTC3639EMSE#TRPBF
U2 U3 = HyTechDevices:ISO224*: ISO224*: Isolated precision amplifier ISO224A: Low-Grade ISO224B: High-Grade ISO224* Datasheet <https://www.ti.com/lit/ds/symlink/iso224.pdf?HQS=dis-dk-null-digikeymode-dsf-pf-null-wwe&ts=1625423566252&ref_url=https%253A%252F%252Fwww.ti.com%252Fgeneral%252Fdocs%252Fsuppproductinfo.tsp%253FdistId%253D10%2526gotoUrl%253Dhttps%253A%252F%252Fwww.ti.com%252Flit%252Fgpn%252Fiso224>; DKPN: 296-52316-1-ND; MANUFACTURER: Texas Instruments; MOPN: 595-ISO224BDWVR; MPN: ISO224BDWVR
U4 = HyTechDevices:VOLTAGE_REGULATOR_?_*: Voltage Regulators LDL1117S50R Datasheet <https://www.mouser.com/datasheet/2/389/dm00366442-1799212.pdf> NCP785AH120T1G <https://www.mouser.com/datasheet/2/308/NCP785A_D-1812704.pdf>; DKPN: 497-17240-1-ND; MANUFACTURER: STMicroelectronics; MOPN: 511-LDL1117S50R; MPN: LDL1117S50R
U100 U101 = HyTechDevicesTempTSB:LTC6994-*: Analog Devices Inc Delay IC 1us to 33.6s Datasheet <https://www.mouser.com/datasheet/2/609/LTC6994_1_6994_2-1270043.pdf>
U102 = HyTechDevices:VOLTAGE_REGULATOR_ADJ_*_?: Adjustable voltage regulators. LR8 Datasheet <https://ww1.microchip.com/downloads/en/DeviceDoc/20005399B.pdf>; DKPN: LR8K4-GTR-ND; MANUFACTURER: Microchip Technology; MOPN: 689-LR8K4-G; MPN: LR8K4-G
U103 = HyTechDevicesTempTSB:DCM4623TD2J13D0T70: 400W 300V to 12V step-down DC-DC converter Datasheet <https://www.mouser.com/datasheet/2/685/DCM4623xD2J13D0y7z_ds-1144763.pdf>; DKPN: 1102-DCM4623TD2J13D0T70-ND; MANUFACTURER: Vicor; MOPN: 492-DCM4623D2J13D0T7; MPN: DCM4623TD2J13D0T70
XF1 = HyTechDevices:FUSE_HOLDER_*: Fuse Holder All PNs for the holder; if Miniblade Fuses <https://www.littelfuse.com/media?resourcetype=datasheets&itemid=0f5f58cb-559e-494b-8d53-723f30445ae5&filename=littelfuse-mini-datasheet> needed, order separately. Mini-Blade PTH <https://www.mouser.com/datasheet/2/215/3568-742601.pdf> Mini-Blade SMD <https://www.mouser.com/datasheet/2/215/588-744913.pdf>; DKPN: 36-3568-ND; MANUFACTURER: Keystone; MOPN: 534-3568; MPN: 3568